# Altium project ZYNQ-7020-Core.PrjPcb (part 1 of 2)
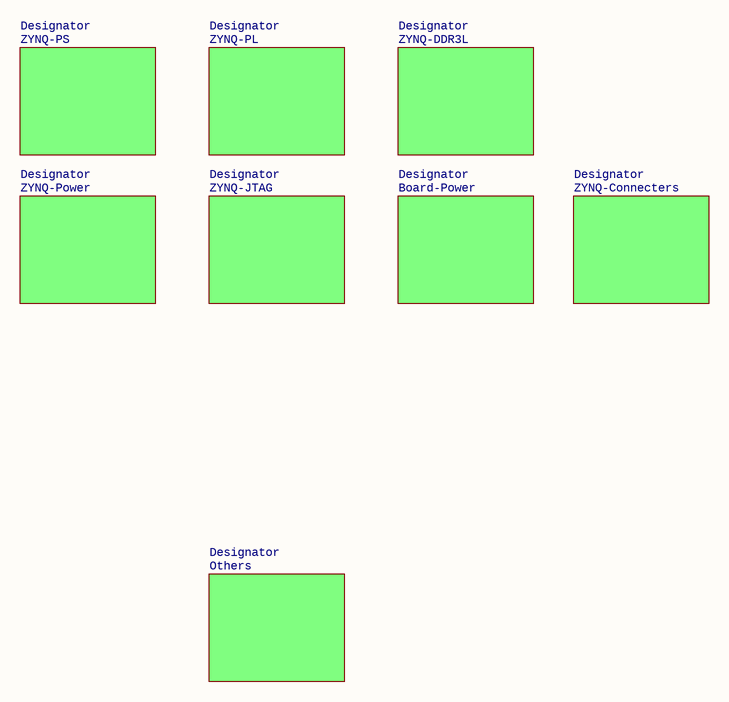
[diagram p0: Top.SchDoc]
9 sheets, 309 parts. Net scope: global (net labels, ports and power ports of the same name join across sheets).
Board file: PCB1.PcbDoc
Sheets:
  Top.SchDoc
    Designator = ZYNQ-PS.SchDoc
    Designator = ZYNQ-Power.SchDoc
    Designator = ZYNQ-PL.SchDoc
    Designator = ZYNQ-DDR3L.SchDoc
    Designator = ZYNQ-JTAG.SchDoc
    Designator = Board-Power.SchDoc
    Designator = Others.SchDoc
    Designator = ZYNQ-Connecters.SchDoc

## Sheet Top.SchDoc
size A3; DrawnBy: 23; Address4: Top; SheetNumber: 1; SheetTotal: 9

### Sub-sheets
Designator = ZYNQ-PS: no entries
Designator = ZYNQ-Power: no entries
Designator = ZYNQ-PL: no entries
Designator = ZYNQ-DDR3L: no entries
Designator = ZYNQ-JTAG: no entries
Designator = Board-Power: no entries
Designator = Others: no entries
Designator = ZYNQ-Connecters: no entries

## Sheet ZYNQ-PS.SchDoc
size A3; SheetNumber: 2; SheetTotal: 9
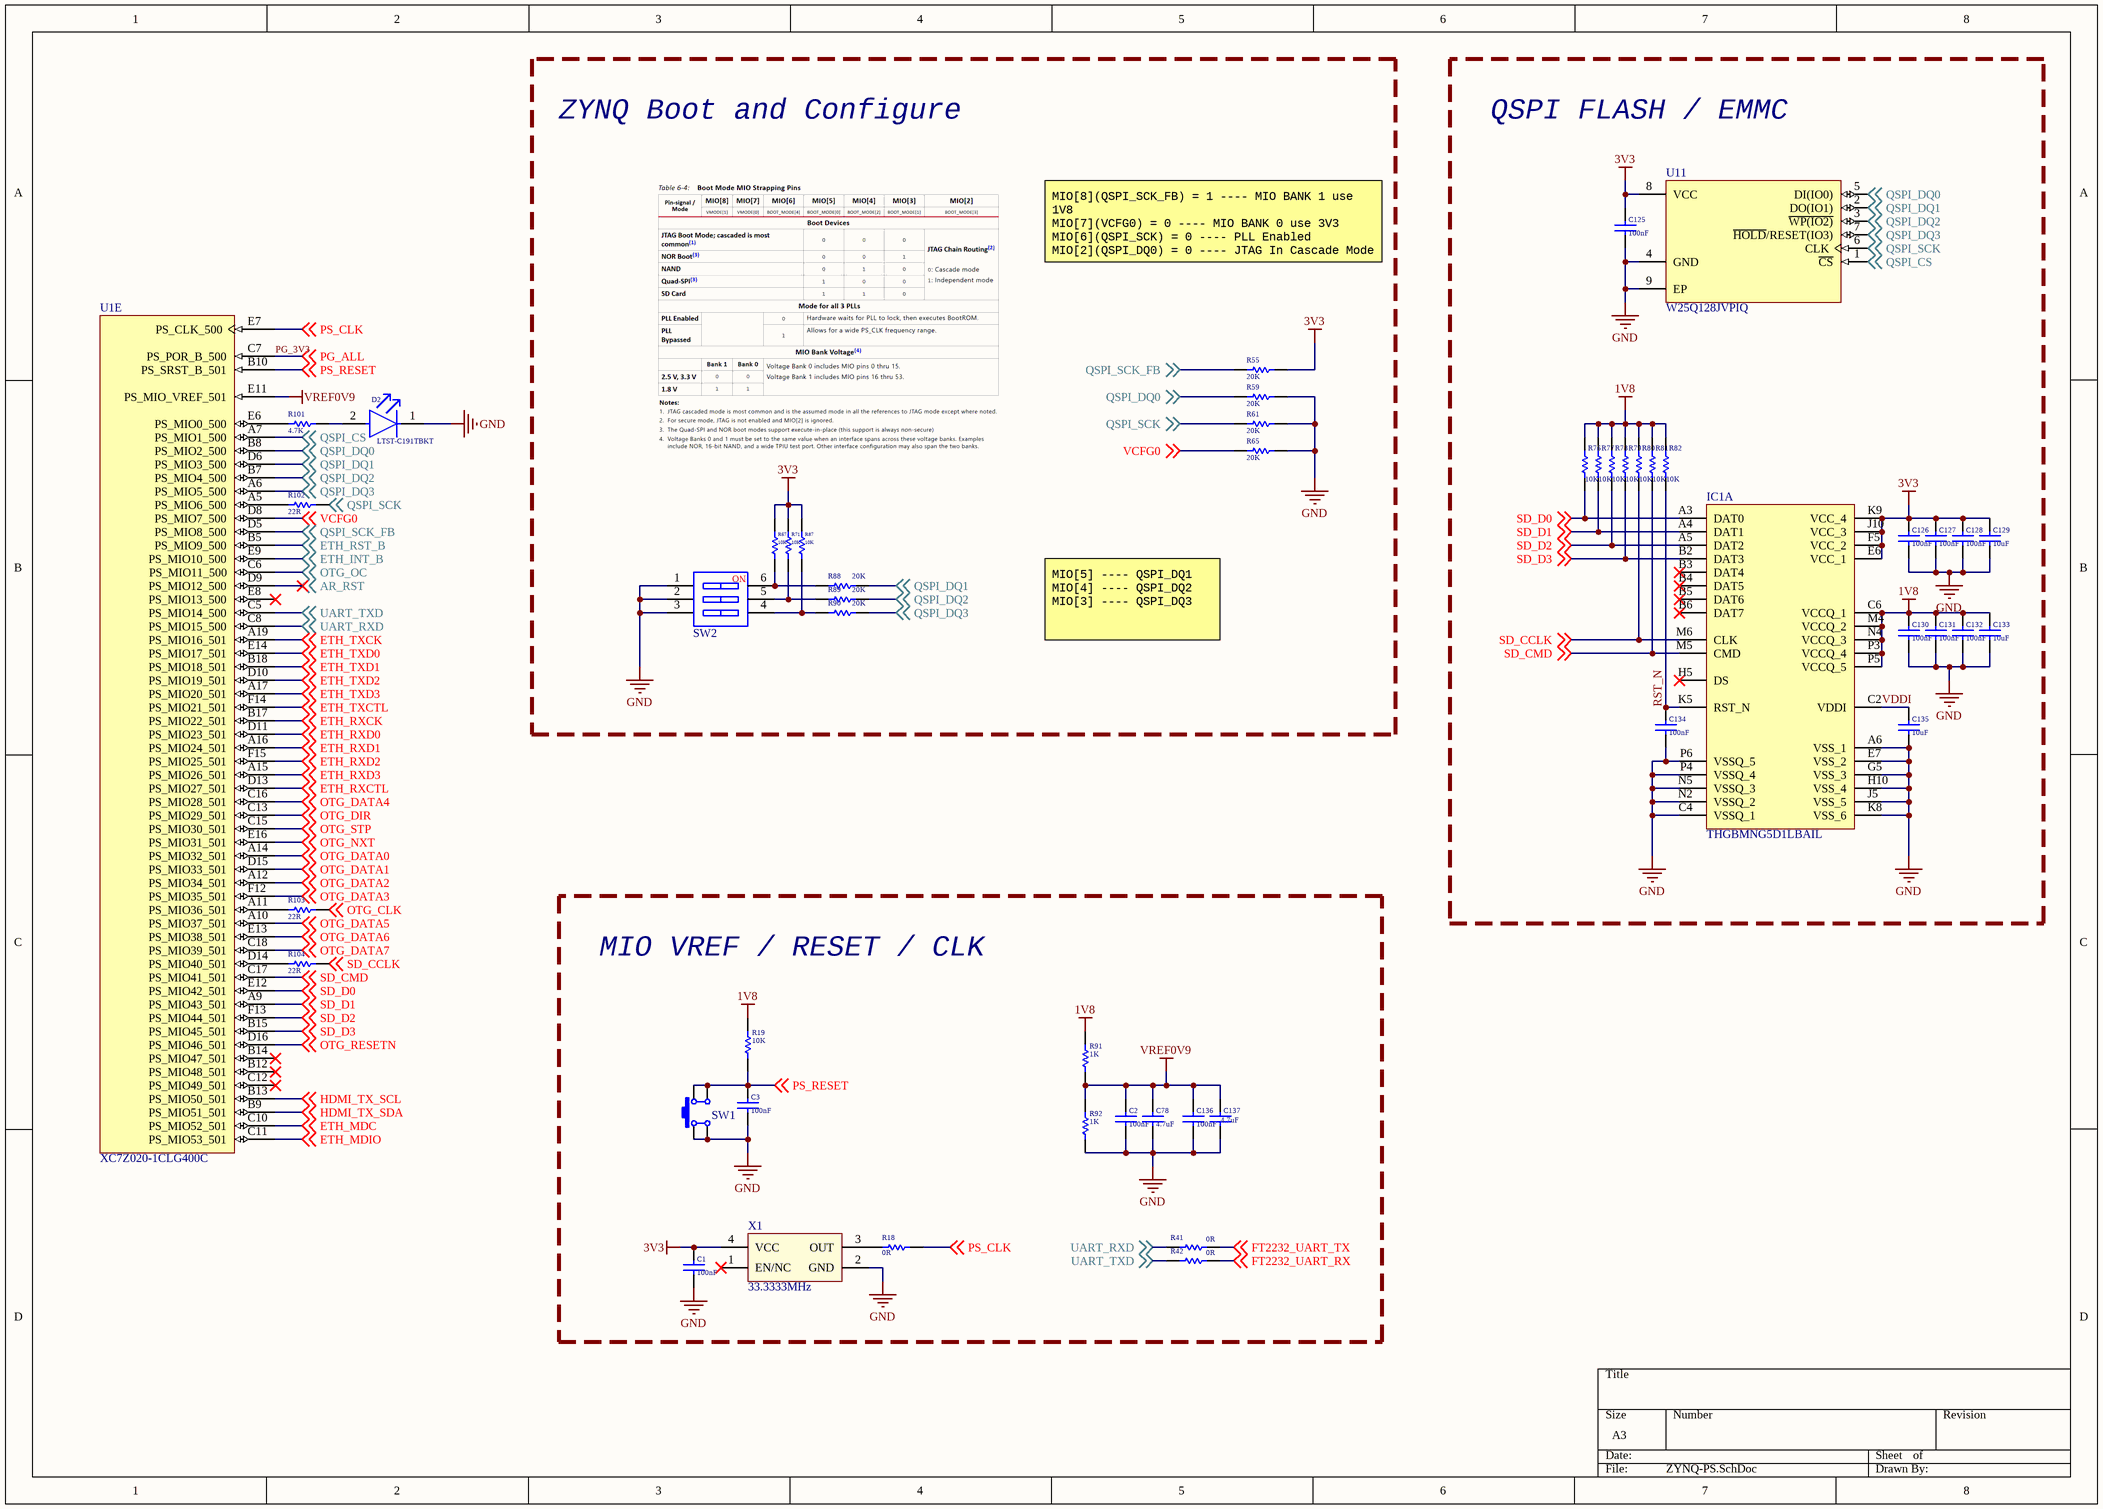
[diagram p1: ZYNQ-PS.SchDoc]

### Parts
C1  100nF  [CAPC1005X55X25LL05T10]
C2  100nF  [CAPC1005X55X25LL05T10]
C3  100nF  [CAPC1005X55X25LL05T10]
C78  4.7uF  [CAPC1005X55X25LL05T10]
C125  100nF  [CAPC1005X55X25LL05T10]
C126  100nF  [CAPC1005X55X25LL05T10]
C127  100nF  [CAPC1005X55X25LL05T10]
C128  100nF  [CAPC1005X55X25LL05T10]
C129  10uF  [CAPC1005X55X25LL05T10]
C130  100nF  [CAPC1005X55X25LL05T10]
C131  100nF  [CAPC1005X55X25LL05T10]
C132  100nF  [CAPC1005X55X25LL05T10]
C133  10uF  [CAPC1005X55X25LL05T10]
C134  100nF  [CAPC1005X55X25LL05T10]
C135  10uF  [CAPC1005X55X25LL05T10]
C136  100nF  [CAPC1005X55X25LL05T10]
C137  4.7uF  [CAPC1005X55X25LL05T10]
D2  LTST-C191TBKT  [FP-LTST-C191TBKT-MFG]
IC1  THGBMNG5D1LBAIL  [BGA153C50P14X14_1150X1300X80]  (part A of 2)
R18  0R  [RESC1005X40X25LL05T05]
R19  10K  [RESC1005X40X25LL05T05]
R41  0R  [RESC1005X40X25LL05T05]
R42  0R  [RESC1005X40X25LL05T05]
R55  20K  [RESC1005X40X25LL05T05]
R59  20K  [RESC1005X40X25LL05T05]
R61  20K  [RESC1005X40X25LL05T05]
R65  20K  [RESC1005X40X25LL05T05]
R67  10K  [RESC1005X40X25LL05T05]
R71  10K  [RESC1005X40X25LL05T05]
R76  10K  [RESC1005X40X25LL05T05]
R77  10K  [RESC1005X40X25LL05T05]
R78  10K  [RESC1005X40X25LL05T05]
R79  10K  [RESC1005X40X25LL05T05]
R80  10K  [RESC1005X40X25LL05T05]
R81  10K  [RESC1005X40X25LL05T05]
R82  10K  [RESC1005X40X25LL05T05]
R87  10K  [RESC1005X40X25LL05T05]
R88  20K  [RESC1005X40X25LL05T05]
R89  20K  [RESC1005X40X25LL05T05]
R90  20K  [RESC1005X40X25LL05T05]
R91  1K  [RESC1005X40X25LL05T05]
R92  1K  [RESC1005X40X25LL05T05]
R101  4.7K  [RESC1005X40X25LL05T05]
R102  22R  [RESC1005X40X25LL05T05]
R103  22R  [RESC1005X40X25LL05T05]
R104  22R  [RESC1005X40X25LL05T05]
SW1  3*4*2.5  [SW-SMD-4.2x3.2_4P]  (value not drawn)
SW2  DIP-SW-3P  [SW1.27 SMD-3P]  (value not drawn)
U1  XC7Z020-1CLG400C  [CLG400]  (part E of 9)
U11  W25Q128JVPIQ  [FP-ZP-IPC_C]
X1  33.3333MHz  [OSC-2025-4P]

### Blocks framed on the sheet
ZYNQ Boot and Configure: R55 R59 R61 R65 R67 R71 R87-R90 SW2
QSPI FLASH / EMMC: C125-C135 IC1 R76-R82 U11
MIO VREF / RESET / CLK: C1-C3 C78 C136 C137 R18 R19 R41 R42 R91 R92 SW1 X1

### Nets
1V8: C130.2 C131.2 C132.2 C133.2 IC1.C6(VCCQ_1) IC1.M4(VCCQ_2) IC1.N4(VCCQ_3) IC1.P3(VCCQ_4) IC1.P5(VCCQ_5) R19.2 R76.2 R77.2 R78.2 R79.2 R80.2 R81.2 R82.2 R91.2
3V3: C1.2 C125.2 C126.2 C127.2 C128.2 C129.2 IC1.E6(VCC_1) IC1.F5(VCC_2) IC1.J10(VCC_3) IC1.K9(VCC_4) R55.1 R67.1 R71.1 R87.1 U11.8(VCC) X1.4(VCC)
GND: C1.1 C2.1 C3.1 C78.1 C125.1 C126.1 C127.1 C128.1 C129.1 C130.1 C131.1 C132.1 C133.1 C134.1 C135.1 C136.1 C137.1 D2.1(C) IC1.A6(VSS_1) IC1.C4(VSSQ_1) IC1.E7(VSS_2) IC1.G5(VSS_3) IC1.H10(VSS_4) IC1.J5(VSS_5) IC1.K8(VSS_6) IC1.N2(VSSQ_2) IC1.N5(VSSQ_3) IC1.P4(VSSQ_4) IC1.P6(VSSQ_5) R59.1 R61.1 R65.1 R92.1 SW1.1 SW1.4 SW2.1 SW2.2 SW2.3 U11.4(GND) U11.9(EP) X1.2(GND)
VREF0V9: C2.2 C78.2 C136.2 C137.2 R91.1 R92.2 U1.E11(PS_MIO_VREF_501)
AR_RST: U1.D9(PS_MIO12_500) ; off-sheet AR_RST
ETH_INT_B: U1.E9(PS_MIO10_500) ; off-sheet ETH_INT_B
ETH_MDC: U1.C10(PS_MIO52_501) ; off-sheet ETH_MDC
ETH_MDIO: U1.C11(PS_MIO53_501) ; off-sheet ETH_MDIO
ETH_RST_B: U1.B5(PS_MIO9_500) ; off-sheet ETH_RST_B
ETH_RXCK: U1.B17(PS_MIO22_501) ; off-sheet ETH_RXCK
ETH_RXCTL: U1.D13(PS_MIO27_501) ; off-sheet ETH_RXCTL
ETH_RXD0: U1.D11(PS_MIO23_501) ; off-sheet ETH_RXD0
ETH_RXD1: U1.A16(PS_MIO24_501) ; off-sheet ETH_RXD1
ETH_RXD2: U1.F15(PS_MIO25_501) ; off-sheet ETH_RXD2
ETH_RXD3: U1.A15(PS_MIO26_501) ; off-sheet ETH_RXD3
ETH_TXCK: U1.A19(PS_MIO16_501) ; off-sheet ETH_TXCK
ETH_TXCTL: U1.F14(PS_MIO21_501) ; off-sheet ETH_TXCTL
ETH_TXD0: U1.E14(PS_MIO17_501) ; off-sheet ETH_TXD0
ETH_TXD1: U1.B18(PS_MIO18_501) ; off-sheet ETH_TXD1
ETH_TXD2: U1.D10(PS_MIO19_501) ; off-sheet ETH_TXD2
ETH_TXD3: U1.A17(PS_MIO20_501) ; off-sheet ETH_TXD3
FT2232_UART_RX: R42.1 ; off-sheet FT2232_UART_RX
FT2232_UART_TX: R41.1 ; off-sheet FT2232_UART_TX
HDMI_TX_SCL: U1.B13(PS_MIO50_501) ; off-sheet HDMI_TX_SCL
HDMI_TX_SDA: U1.B9(PS_MIO51_501) ; off-sheet HDMI_TX_SDA
OTG_CLK: R103.1 ; off-sheet OTG_CLK
OTG_DATA0: U1.A14(PS_MIO32_501) ; off-sheet OTG_DATA0
OTG_DATA1: U1.D15(PS_MIO33_501) ; off-sheet OTG_DATA1
OTG_DATA2: U1.A12(PS_MIO34_501) ; off-sheet OTG_DATA2
OTG_DATA3: U1.F12(PS_MIO35_501) ; off-sheet OTG_DATA3
OTG_DATA4: U1.C16(PS_MIO28_501) ; off-sheet OTG_DATA4
OTG_DATA5: U1.A10(PS_MIO37_501) ; off-sheet OTG_DATA5
OTG_DATA6: U1.E13(PS_MIO38_501) ; off-sheet OTG_DATA6
OTG_DATA7: U1.C18(PS_MIO39_501) ; off-sheet OTG_DATA7
OTG_DIR: U1.C13(PS_MIO29_501) ; off-sheet OTG_DIR
OTG_NXT: U1.E16(PS_MIO31_501) ; off-sheet OTG_NXT
OTG_OC: U1.C6(PS_MIO11_500) ; off-sheet OTG_OC
OTG_RESETN: U1.D16(PS_MIO46_501) ; off-sheet OTG_RESETN
OTG_STP: U1.C15(PS_MIO30_501) ; off-sheet OTG_STP
PG_3V3: U1.C7(PS_POR_B_500) ; off-sheet PG_ALL  [also labelled PG_ALL]
PS_CLK: R18.2 U1.E7(PS_CLK_500) ; off-sheet PS_CLK
PS_RESET: C3.2 R19.1 SW1.2 SW1.3 U1.B10(PS_SRST_B_501) ; off-sheet PS_RESET
QSPI_CS: U1.A7(PS_MIO1_500) U11.1(~{CS}) ; off-sheet QSPI_CS
QSPI_DQ0: R59.2 U1.B8(PS_MIO2_500) U11.5(DI(IO0)) ; off-sheet QSPI_DQ0
QSPI_DQ1: R88.1 U1.D6(PS_MIO3_500) U11.2(DO(IO1)) ; off-sheet QSPI_DQ1
QSPI_DQ2: R89.1 U1.B7(PS_MIO4_500) U11.3(~{WP(IO2)}) ; off-sheet QSPI_DQ2
QSPI_DQ3: R90.1 U1.A6(PS_MIO5_500) U11.7(~{HOLD}/RESET(IO3)) ; off-sheet QSPI_DQ3
QSPI_SCK: R61.2 R102.1 U11.6(CLK) ; off-sheet QSPI_SCK
QSPI_SCK_FB: R55.2 U1.D5(PS_MIO8_500) ; off-sheet QSPI_SCK_FB
RST_N: C134.2 IC1.K5(RST_N) R82.1
SD_CCLK: IC1.M6(CLK) R80.1 R104.1 ; off-sheet SD_CCLK
SD_CMD: IC1.M5(CMD) R81.1 U1.C17(PS_MIO41_501) ; off-sheet SD_CMD
SD_D0: IC1.A3(DAT0) R76.1 U1.E12(PS_MIO42_501) ; off-sheet SD_D0
SD_D1: IC1.A4(DAT1) R77.1 U1.A9(PS_MIO43_501) ; off-sheet SD_D1
SD_D2: IC1.A5(DAT2) R78.1 U1.F13(PS_MIO44_501) ; off-sheet SD_D2
SD_D3: IC1.B2(DAT3) R79.1 U1.B15(PS_MIO45_501) ; off-sheet SD_D3
UART_RXD: R41.2 U1.C8(PS_MIO15_500) ; off-sheet UART_RXD
UART_TXD: R42.2 U1.C5(PS_MIO14_500) ; off-sheet UART_TXD
VCFG0: R65.2 U1.D8(PS_MIO7_500) ; off-sheet VCFG0
VDDI: C135.2 IC1.C2(VDDI)
NetD2_2: D2.2(A) R101.1
NetR18_1: R18.1 X1.3(OUT)
NetR67_2: R67.2 R88.2 SW2.6
NetR71_2: R71.2 R89.2 SW2.5
NetR87_2: R87.2 R90.2 SW2.4
NetR101_2: R101.2 U1.E6(PS_MIO0_500)
NetR102_2: R102.2 U1.A5(PS_MIO6_500)
NetR103_2: R103.2 U1.A11(PS_MIO36_501)
NetR104_2: R104.2 U1.D14(PS_MIO40_501)

Not connected (* = marked no-connect by the designer): IC1 B3(DAT4)* B4(DAT5)* B5(DAT6)* B6(DAT7)* H5(DS)*; U1 B12(PS_MIO48_501)* B14(PS_MIO47_501)* C12(PS_MIO49_501)* E8(PS_MIO13_500)*; X1 1(EN/NC)*

### Notes on the sheet
- MIO[8](QSPI_SCK_FB) = 1 ---- MIO BANK 1 use 1V8
  MIO[7](VCFG0) = 0 ---- MIO BANK 0 use 3V3
  MIO[6](QSPI_SCK) = 0 ---- PLL Enabled
  MIO[2](QSPI_DQ0) = 0 ---- JTAG In Cascade Mode
- MIO[5] ---- QSPI_DQ1
  MIO[4] ---- QSPI_DQ2
  MIO[3] ---- QSPI_DQ3
- (in symbol DIP-SW-3P) NO

### Library data of the parts
C1-C3 C78 C125-C137 = CMP-2008-04639-1: Part Number: GRM155R71H104KE14D; Manufacturer: Murata
D2 = CMP-22017-000008-1: LED BLUE CLEAR CHIP SMD; Reverse Voltage: 5V; Dominant Wavelength: 475nm; Luminous Intensity: 180mcd; Number of LEDs: 1; Lens Color: Colorless; Lens Style: Diffused; Wavelength: 468nm; Forward Current: 20mA; Forward Voltage: 3.8V; Max Power Dissipation: 75mW; Viewing Angle: 130°; Power Dissipation: 76mW; Number of Pins: 2; Package Quantity: 1; Illumination Color: Blue; Lens Transparency: Clear; Max Operating Temperature: 80°C; Height: 0.55mm; Case Code (Imperial): 0603; Min Operating Temperature: -20°C; Width: 0.8mm; Test Current: 20mA; Depth: 1.6mm; Number of Elements: 1; Color: Blue; Lead Free: Lead Free; Packaging: Tape and Reel; Case Code (Metric): 1608; Radiation Hardening: No; Mount: Surface Mount; Length: 0.8mm; Case/Package: 0603
IC1 = THGBMNG5D1LBAIL: Integrated Circuit; Manufacturer_Name: Toshiba; Datasheet Link: https://datasheet.lcsc.com/szlcsc/1906131632_TOSHIBA-THGBMNG5D1LBAIL_C391255.pdf; Height: 0.8mm; Manufacturer_Part_Number: THGBMNG5D1LBAIL; Mouser Part Number: N/A; Mouser Price/Stock: https://www.mouser.co.uk/ProductDetail/Toshiba/THGBMNG5D1LBAIL?qs=Znm5pLBrcAKyiWgFGEjr8Q%3D%3D
R18 R19 R41 R42 R55 R59 R61 R65 R67 R71 R76-R82 R87-R92 R101-R104 = CMP-2002-00921-1: Manufacturer: Panasonic; Part Number: ERJ-2RKF40R2X
SW1 = SW SMD-3*4*2.5: 贴片4脚轻触开关; 联系下单店铺卖家 免费技术支持: 联系下单店铺卖家 免费帮你查找封装
SW2 = DIP-SW-3P: 3路拨码开关; 联系下单店铺卖家 免费技术支持: 联系下单店铺卖家 免费帮你查找封装; BOM名称: 3路拨码开关
U1 = CMP-0363-00002-3: 667 MHz Zynq™-7000 AP SoC, 130 PS I/O, 125 FPGA I/O, 400-Ball BGA, Speed Grade 1, Commercial Grade, Pb-Free; Flip Flops: 106400; Speed Grade: -1; LUTs: 53200; Extensible Block RAM (# 36Kb Blocks): 560 KB (140); PackageVersion: Rev 1.1, 09/2012; ComponentLink1Description: Datasheet; ComponentLink2Description: Package Specification; ComponentLink6Description: PCB and Layout Guide; PackageDescription: Wire-Bond Chip-Scale BGA, Body 17 x 17 mm, 0.8 mm Pitch; RoHS: Pb-Free; DatasheetVersion: v1.2; Mounting Technology: Surface Mount; ComponentLink5Description: Packaging and Pinout; ComponentLink5URL: http://www.xilinx.com/support/documentation/user_guides/ug865-Zynq-7000-Pkg-Pinout.pdf; ComponentLink6URL: http://www.xilinx.com/support/documentation/user_guides/ug483_7Series_PCB.pdf; Generic Part Number: XC7Z020; ComponentLink3Description: DC and AC Switching Characteristics; ComponentLink2URL: http://www.xilinx.com/support/documentation/user_guides/ug865-Zynq-7000-Pkg-Pinout.pdf; ComponentLink4Description: Package File; ComponentLink1URL: http://www.xilinx.com/support/documentation/data_sheets/ds190-Zynq-7000-Overview.pdf; PackageReference: CLG400; ComponentLink3URL: http://www.xilinx.com/support/documentation/data_sheets/ds187-XC7Z010-XC7Z020-Data-Sheet.pdf; PartNumber: XC7Z020-1CLG400C; ComponentLink4URL: http://www.xilinx.com/support/packagefiles/z7packages/xc7z020clg400pkg.txt; Code_JEDEC: MO-275-MMAA-1
U11 = CMP-00084-1: NOR Flash Serial (SPI, Dual SPI, Quad SPI) 3V/3.3V 128M-bit 16M x 8 6ns 8-Pin WSON EP T/R/Tray/Tube; Memory Format: Non-Volatile,FLASH; Frequency: 133MHz; Memory Size: 128Mb; Mounting Technology: Surface Mount; Packaging: Rail/Tube; Series: SpiFlash®; Max Operating Temperature: 85°C; RoHS Compliant: Yes; Min Operating Temperature: -40°C
X1 = XTAL-ACT-4P: 4脚有源晶振(振荡器); 联系下单店铺卖家 免费帮你查找封装: 联系下单店铺卖家 免费技术支持; BOM名称: 有源晶振(振荡器)

## Sheet ZYNQ-Power.SchDoc
size A3; SheetNumber: 3; SheetTotal: 9; SPICEModelCacheBYAJFYWK: <root> / <DocumentId>BYAJFYWK</DocumentId> / <CacheFrame Number="0"> / <Model Name="emk063bbj474_plf" Kind="CKT"> / <Text>* EMK063BBJ474_PLF     SPICE MODEL  ( General Type ) / *-------------------------------------------------------------------------------------------------------- / * Model Generated by TAIYO YUDEN Corporation (http://www.ty-top.com) / * Version 1.0 / * TAIYO YUDEN Control No. 170613 / * Copyright(c) 2017 TAIYO YUDEN CO.,LTD. All Rights Reserved. / *-------------------------------------------------------------------------------------------------------- / * / * Products Name : Multilayer Ceramic Capacitors / * / * Characteristics : / *     Capacitance : 0.47 uF , Rated Voltage : 16V , TCC : X5R / *     Case Size : 0.6 x 0.3 / 0.024 x 0.012 [mm/inch] , Thickness : 0.3 / 0.012 [mm/inch] / *     (Conditions: Temperature = 25 degC , DC Bias Current/Voltage = 0A / 0V) / * / * Frequency Range : 40Hz - 3GHz / * / * External Node Assignments : / * / *  1  o---| |---o  2 / * / *-------------------------------------------------------------------------------------------------------- / .SubCkt EMK063BBJ474_PLF 1 2 / **************************** / C0 1 110 0.343u / Cm 1 101 0.070566u / C1 101 102 0.19677u / Rc1 101 102 5.4832k / C2 102 103 0.088709u / Rc2 102 103 328.07 / C3 103 110 0.045948u / Rc3 103 110 5.95 / C2m 1 301 0.10435u / C21 301 302 1.1799u / Rc21 301 302 9.4241k / C22 302 303 0.78774u / Rc22 302 303 13.724k / C23 303 304 0.3659u / Rc23 303 304 10.75k / C24 304 305 0.19785u / Rc24 304 305 937.28 / C25 305 306 0.79433u / Rc25 305 306 187.76 / C26 306 307 0.2114u / Rc26 306 307 57.148 / C27 307 308 0.12309u / Rc27 307 308 22.875 / C28 308 309 0.060909u / Rc28 308 309 28.453 / C29 309 110 2918.5p / Rc29 309 110 0.61373 / Rp0 1 110 212.765957446809Meg / L0 110 120 0.12773n / Lm 120 130 0.093632n / L1 120 121 0.017026n / RL1 121 130 0.51897 / L2 120 122 0.039017n / RL2 122 130 1.1018 / L3 120 123 0.19653n / RL3 123 130 98.604m / CR 120 124 0.08294u / LR 124 125 0.038088n / RR 125 130 0.10805 / CL 130 140 3.8165p / LL 130 140 0.069007n / RL 130 140 4.9149k / Rs 140 2 8.9319m / **************************** / .ends EMK063BBJ474_PLF</Text> / </Model> / </CacheFrame> / </root>
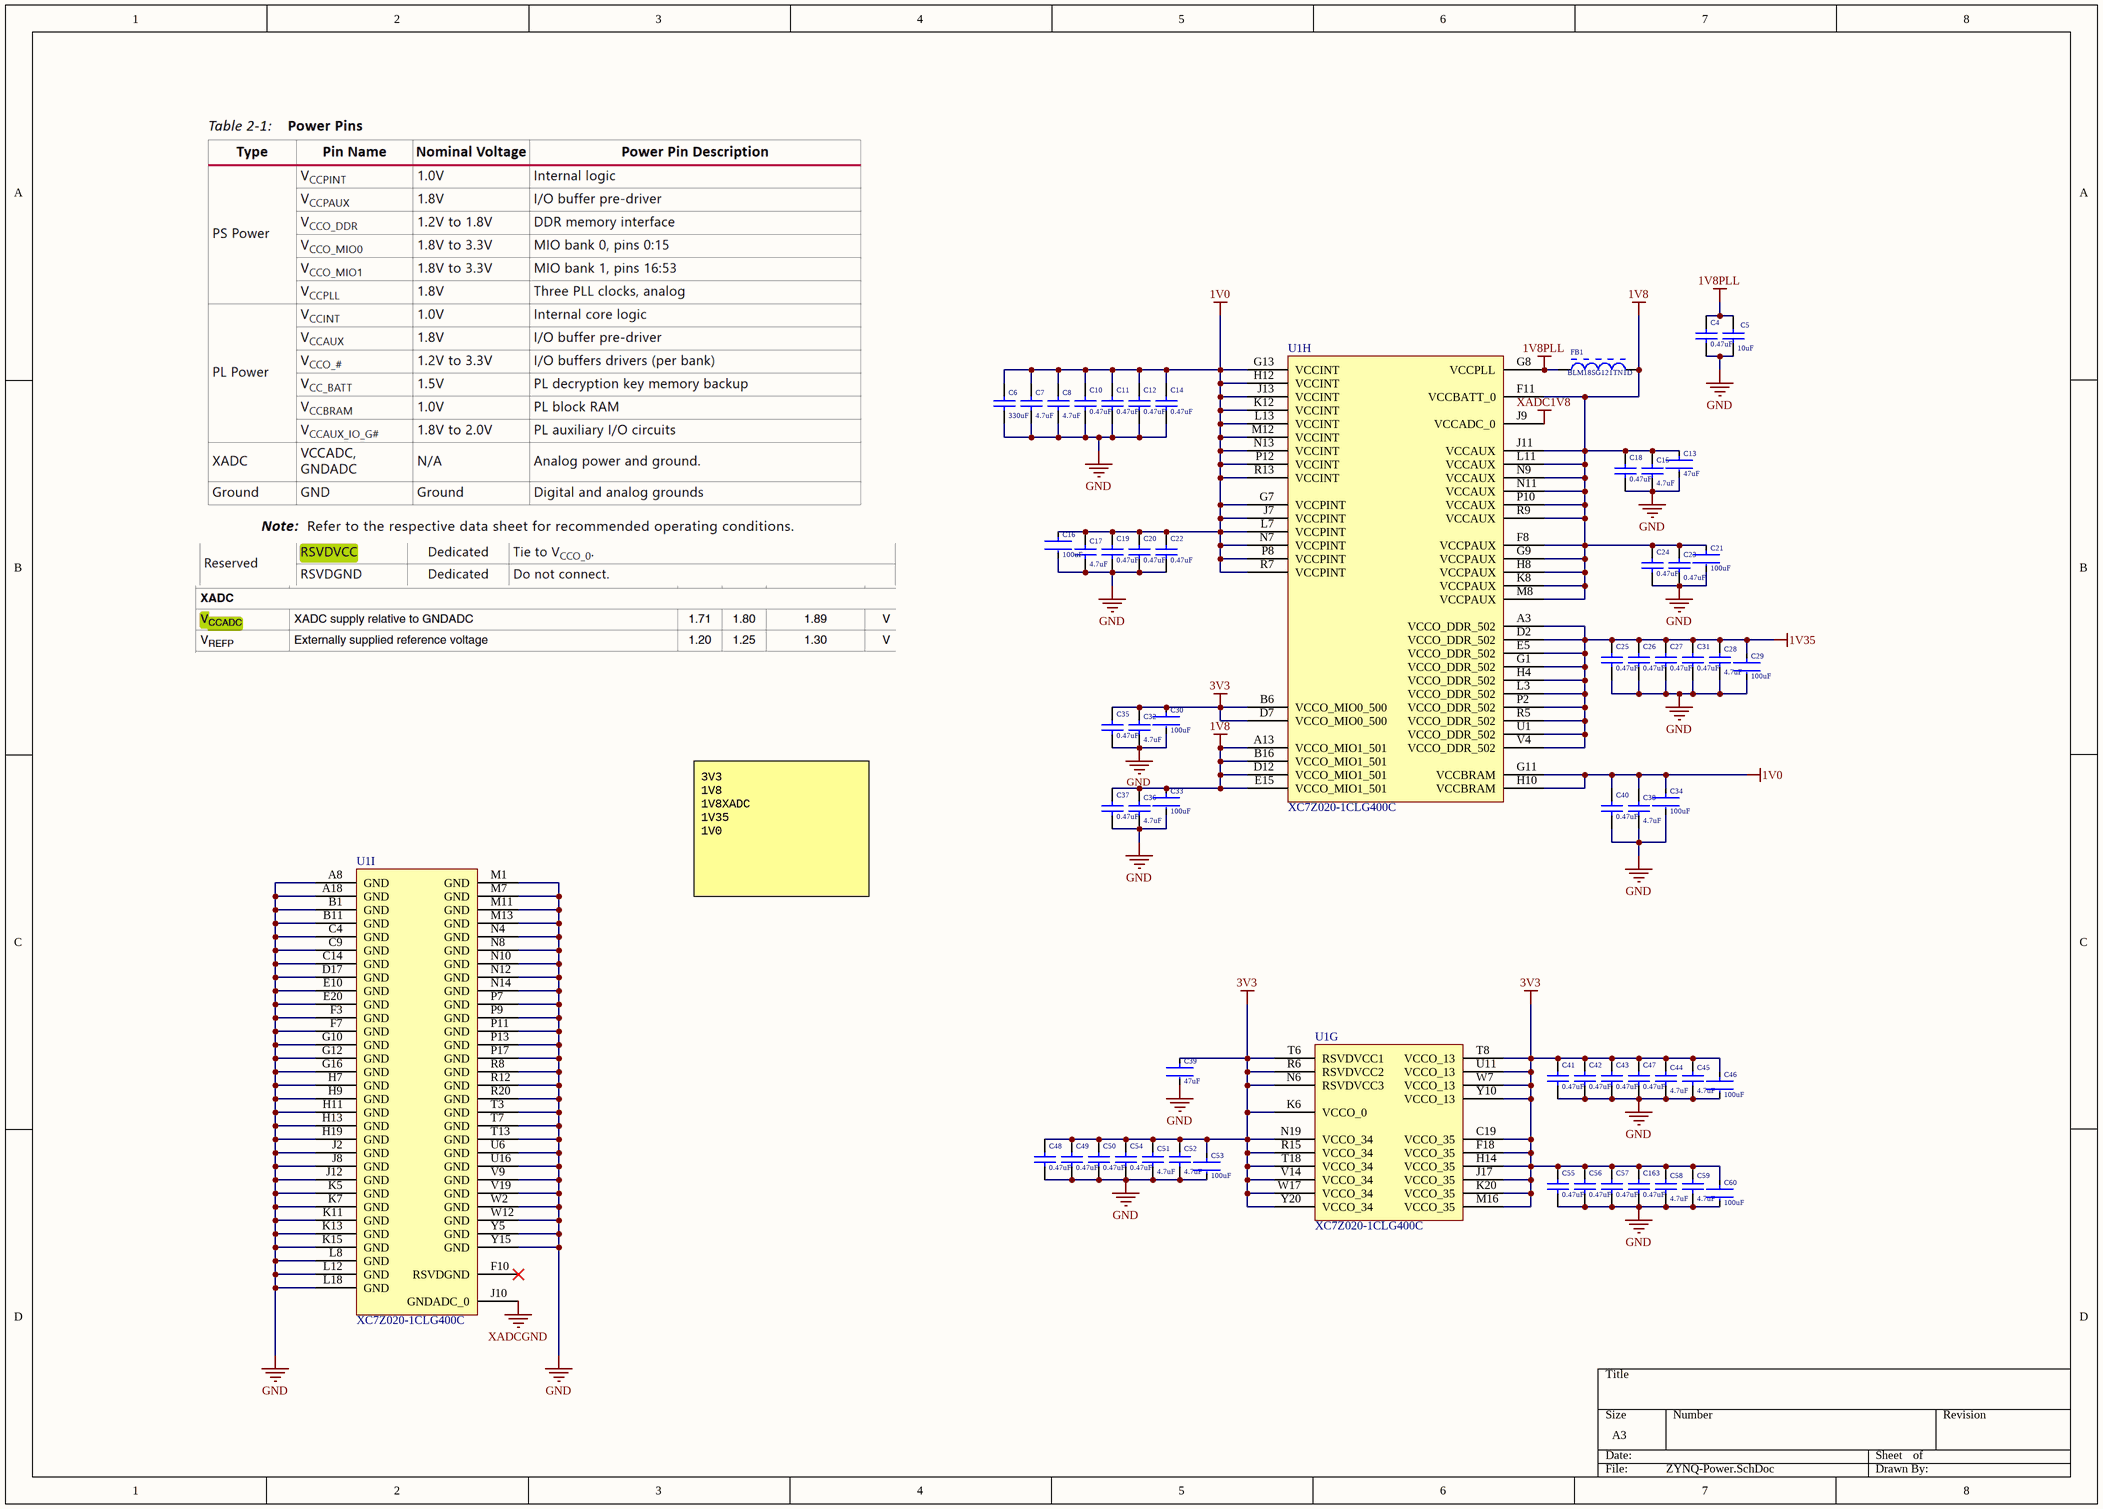
[diagram p2: ZYNQ-Power.SchDoc]

### Parts
C4  0.47uF  [FP-0201-L_0_6_0_09-W_0_3-IPC_A]
C5  10uF  [CAPC1608X90X35LL10T15]
C6  330uF  [CAPC3225X270X30LL30]
C7  4.7uF  [CAPC1005X55X25LL05T10]
C8  4.7uF  [CAPC1005X55X25LL05T10]
C10  0.47uF  [FP-0201-L_0_6_0_09-W_0_3-IPC_A]
C11  0.47uF  [FP-0201-L_0_6_0_09-W_0_3-IPC_A]
C12  0.47uF  [FP-0201-L_0_6_0_09-W_0_3-IPC_A]
C13  47uF  [FP-GCM31C-0_2-e0_3_0_8-IPC_C]
C14  0.47uF  [FP-0201-L_0_6_0_09-W_0_3-IPC_A]
C15  4.7uF  [CAPC1005X55X25LL05T10]
C16  100uF  [FP-GCM31C-0_2-e0_3_0_8-IPC_C]
C17  4.7uF  [CAPC1005X55X25LL05T10]
C18  0.47uF  [FP-0201-L_0_6_0_09-W_0_3-IPC_A]
C19  0.47uF  [FP-0201-L_0_6_0_09-W_0_3-IPC_A]
C20  0.47uF  [FP-0201-L_0_6_0_09-W_0_3-IPC_A]
C21  100uF  [FP-GCM31C-0_2-e0_3_0_8-IPC_C]
C22  0.47uF  [FP-0201-L_0_6_0_09-W_0_3-IPC_A]
C23  0.47uF  [CAPC1005X55X25LL05T10]
C24  0.47uF  [FP-0201-L_0_6_0_09-W_0_3-IPC_A]
C25  0.47uF  [FP-0201-L_0_6_0_09-W_0_3-IPC_A]
C26  0.47uF  [FP-0201-L_0_6_0_09-W_0_3-IPC_A]
C27  0.47uF  [FP-0201-L_0_6_0_09-W_0_3-IPC_A]
C28  4.7uF  [CAPC1005X55X25LL05T10]
C29  100uF  [FP-GCM31C-0_2-e0_3_0_8-IPC_C]
C30  100uF  [FP-GCM31C-0_2-e0_3_0_8-IPC_C]
C31  0.47uF  [FP-0201-L_0_6_0_09-W_0_3-IPC_A]
C32  4.7uF  [CAPC1005X55X25LL05T10]
C33  100uF  [FP-GCM31C-0_2-e0_3_0_8-IPC_C]
C34  100uF  [FP-GCM31C-0_2-e0_3_0_8-IPC_C]
C35  0.47uF  [FP-0201-L_0_6_0_09-W_0_3-IPC_A]
C36  4.7uF  [CAPC1005X55X25LL05T10]
C37  0.47uF  [FP-0201-L_0_6_0_09-W_0_3-IPC_A]
C38  4.7uF  [CAPC1005X55X25LL05T10]
C39  47uF  [FP-GCM31C-0_2-e0_3_0_8-IPC_C]
C40  0.47uF  [FP-0201-L_0_6_0_09-W_0_3-IPC_A]
C41  0.47uF  [FP-0201-L_0_6_0_09-W_0_3-IPC_A]
C42  0.47uF  [FP-0201-L_0_6_0_09-W_0_3-IPC_A]
C43  0.47uF  [FP-0201-L_0_6_0_09-W_0_3-IPC_A]
C44  4.7uF  [CAPC1005X55X25LL05T10]
C45  4.7uF  [CAPC1005X55X25LL05T10]
C46  100uF  [FP-GCM31C-0_2-e0_3_0_8-IPC_C]
C47  0.47uF  [FP-0201-L_0_6_0_09-W_0_3-IPC_A]
C48  0.47uF  [FP-0201-L_0_6_0_09-W_0_3-IPC_A]
C49  0.47uF  [FP-0201-L_0_6_0_09-W_0_3-IPC_A]
C50  0.47uF  [FP-0201-L_0_6_0_09-W_0_3-IPC_A]
C51  4.7uF  [CAPC1005X55X25LL05T10]
C52  4.7uF  [CAPC1005X55X25LL05T10]
C53  100uF  [FP-GCM31C-0_2-e0_3_0_8-IPC_C]
C54  0.47uF  [FP-0201-L_0_6_0_09-W_0_3-IPC_A]
C55  0.47uF  [FP-0201-L_0_6_0_09-W_0_3-IPC_A]
C56  0.47uF  [FP-0201-L_0_6_0_09-W_0_3-IPC_A]
C57  0.47uF  [FP-0201-L_0_6_0_09-W_0_3-IPC_A]
C58  4.7uF  [CAPC1005X55X25LL05T10]
C59  4.7uF  [CAPC1005X55X25LL05T10]
C60  100uF  [FP-GCM31C-0_2-e0_3_0_8-IPC_C]
C163  0.47uF  [FP-0201-L_0_6_0_09-W_0_3-IPC_A]
FB1  BLM18SG121TN1D  [MURA-BLM18SG-B40-CHIP-2_V6]
U1  XC7Z020-1CLG400C  [CLG400]  (parts G,H,I of 9)

### Nets
1V0: C6.2 C7.2 C8.2 C10.2 C11.2 C12.2 C14.2 C16.1 C17.2 C19.2 C20.2 C22.2 C34.1 C38.2 C40.2 U1.G7(VCCPINT) U1.G11(VCCBRAM) U1.G13(VCCINT) U1.H10(VCCBRAM) U1.H12(VCCINT) U1.J7(VCCPINT) U1.J13(VCCINT) U1.K12(VCCINT) U1.L7(VCCPINT) U1.L13(VCCINT) U1.M12(VCCINT) U1.N7(VCCPINT) U1.N13(VCCINT) U1.P8(VCCPINT) U1.P12(VCCINT) U1.R7(VCCPINT) U1.R13(VCCINT)
1V8: C13.1 C15.2 C18.2 C21.1 C23.2 C24.2 C33.1 C36.2 C37.2 FB1.2 U1.A13(VCCO_MIO1_501) U1.B16(VCCO_MIO1_501) U1.D12(VCCO_MIO1_501) U1.E15(VCCO_MIO1_501) U1.F8(VCCPAUX) U1.F11(VCCBATT_0) U1.G9(VCCPAUX) U1.H8(VCCPAUX) U1.J11(VCCAUX) U1.K8(VCCPAUX) U1.L11(VCCAUX) U1.M8(VCCPAUX) U1.N9(VCCAUX) U1.N11(VCCAUX) U1.P10(VCCAUX) U1.R9(VCCAUX)
1V8PLL: C4.2 C5.2 FB1.1 U1.G8(VCCPLL)
1V35: C25.2 C26.2 C27.2 C28.2 C29.1 C31.2 U1.A3(VCCO_DDR_502) U1.D2(VCCO_DDR_502) U1.E5(VCCO_DDR_502) U1.G1(VCCO_DDR_502) U1.H4(VCCO_DDR_502) U1.L3(VCCO_DDR_502) U1.P2(VCCO_DDR_502) U1.R5(VCCO_DDR_502) U1.U1(VCCO_DDR_502) U1.V4(VCCO_DDR_502)
3V3: C30.1 C32.2 C35.2 C39.1 C41.2 C42.2 C43.2 C44.2 C45.2 C46.1 C47.2 C48.2 C49.2 C50.2 C51.2 C52.2 C53.1 C54.2 C55.2 C56.2 C57.2 C58.2 C59.2 C60.1 C163.2 U1.B6(VCCO_MIO0_500) U1.C19(VCCO_35) U1.D7(VCCO_MIO0_500) U1.F18(VCCO_35) U1.H14(VCCO_35) U1.J17(VCCO_35) U1.K6(VCCO_0) U1.K20(VCCO_35) U1.M16(VCCO_35) U1.N6(RSVDVCC3) U1.N19(VCCO_34) U1.R6(RSVDVCC2) U1.R15(VCCO_34) U1.T6(RSVDVCC1) U1.T8(VCCO_13) U1.T18(VCCO_34) U1.U11(VCCO_13) U1.V14(VCCO_34) U1.W7(VCCO_13) U1.W17(VCCO_34) U1.Y10(VCCO_13) U1.Y20(VCCO_34)
GND: C4.1 C5.1 C6.1 C7.1 C8.1 C10.1 C11.1 C12.1 C13.2 C14.1 C15.1 C16.2 C17.1 C18.1 C19.1 C20.1 C21.2 C22.1 C23.1 C24.1 C25.1 C26.1 C27.1 C28.1 C29.2 C30.2 C31.1 C32.1 C33.2 C34.2 C35.1 C36.1 C37.1 C38.1 C39.2 C40.1 C41.1 C42.1 C43.1 C44.1 C45.1 C46.2 C47.1 C48.1 C49.1 C50.1 C51.1 C52.1 C53.2 C54.1 C55.1 C56.1 C57.1 C58.1 C59.1 C60.2 C163.1 U1.A8(GND) U1.A18(GND) U1.B1(GND) U1.B11(GND) U1.C4(GND) U1.C9(GND) U1.C14(GND) U1.D17(GND) U1.E10(GND) U1.E20(GND) U1.F3(GND) U1.F7(GND) U1.G10(GND) U1.G12(GND) U1.G16(GND) U1.H7(GND) U1.H9(GND) U1.H11(GND) U1.H13(GND) U1.H19(GND) U1.J2(GND) U1.J8(GND) U1.J12(GND) U1.K5(GND) U1.K7(GND) U1.K11(GND) U1.K13(GND) U1.K15(GND) U1.L8(GND) U1.L12(GND) U1.L18(GND) U1.M1(GND) U1.M7(GND) U1.M11(GND) U1.M13(GND) U1.N4(GND) U1.N8(GND) U1.N10(GND) U1.N12(GND) U1.N14(GND) U1.P7(GND) U1.P9(GND) U1.P11(GND) U1.P13(GND) U1.P17(GND) U1.R8(GND) U1.R12(GND) U1.R20(GND) U1.T3(GND) U1.T7(GND) U1.T13(GND) U1.U6(GND) U1.U16(GND) U1.V9(GND) U1.V19(GND) U1.W2(GND) U1.W12(GND) U1.Y5(GND) U1.Y15(GND)
XADC1V8: U1.J9(VCCADC_0)
XADCGND: U1.J10(GNDADC_0)

Not connected (* = marked no-connect by the designer): U1 F10(RSVDGND)*

### Notes on the sheet
- 3V3
  1V8
  1V8XADC
  1V35
  1V0

### Library data of the parts
C4 C10-C12 C14 C18-C20 C22 C24-C27 C31 C35 C37 C40-C43 C47-C50 C54-C57 C163 = CMP-00086-2: Multilayer Ceramic Capacitor 0.47uF 16V 10% 0201 Paper T/R; Value: 470nF; Max Operating Temperature: -55°C; RoHS Compliant: Yes; Height: 390um; Voltage Rating (DC): 16V; Min Operating Temperature: -55°C; Case/Package: 0201; Voltage Rating: 16V; Tolerance: 10%; Material: Ceramic
C5 = CMP-2006-02787-1: GRM188R60G106ME47D Checked Multilayer Ceramic Capacitor, 10 uF, 4 V, ± 20%, X5R, 0603 [1608 Metric] Ceramic Capacitors 0.1; Manufacturer: Murata; Part Number: GRM188R60G106ME47D
C6 = CMP-1662-00021-1: GRM32ER60G337ME05L Checked / Multilayer Ceramic Capacitor, 330 uF, 4 V, ± 20%, X5R, 1210 [3225 Metric] Ceramic Capacitors 1.11; Current Rating: 3 A; Colour: Black; Gender: Male; Contact Plating: Gold; PackageDescription: 2-Pin Surface Mount Device, Body 3.2 x 2.5 mm; Package Quantity: 100; Height: 8.13 mm; Pins: 40; Mount: Through Hole; ComponentLink1URL: http://www.murata.com/; RoHSCompliant: True; Packaging: Tray; ComponentLink2URL: https://datasheet.ciiva.com/3776/2741grm32er71e226ke1523-3776996.pdf; Width: 2.34 mm; Radiation Hardening: No; Lead Pitch: 2.54 mm; Min Operating Temperature: -65degC; Contact Finish: Gold; REACH SVHC: Unknown; Max Operating Temperature: 105degC; DatasheetVersion: Aug-14; Length: 101.19 mm; Contact Material: Bronze; ComponentLink2Description: Datasheet; ComponentLink1Description: Manufacturer URL; PackageReference: 1210
C7 C8 C15 C17 C28 C32 C36 C38 C44 C45 C51 C52 C58 C59 = CMP-2008-04639-1: GRM155R61E475ME15D / Ceramic Capacitor, Multilayer, Ceramic, 25V, 20% +Tol, 20% -Tol, X5R, 15% TC, 4.7uF, Surface Mount, 0402 Capacitors 0.1615; Part Number: GRM155R71H104KE14D; Manufacturer: Murata
C13 C39 = CMP-00080-1: GRM31CR60J476KE19L Checked / Multilayer Ceramic Capacitor, 47 uF, 6.3 V, ± 10%, X5R, 1206 [3216 Metric] Ceramic Capacitors 0.42; RoHS Compliant: Yes
C16 C21 C29 C30 C33 C34 C46 C53 C60 = CMP-00080-1: GRM31CR61A107MEA8K Checked / SMD Multilayer Ceramic Capacitor, 100 µF, 10 V, 1206 [3216 Metric], ± 20%, X5R, GRM Series Ceramic Capacitors 0.58; RoHS Compliant: Yes
C23 = CMP-2008-04639-1: GRM155R61H474KE11D / Multilayer Ceramic Capacitor, 0.47 uF, 50 V, ± 10%, X5R, 0402 [1005 Metric] Ceramic Capacitors 0.1; Part Number: GRM155R71H104KE14D; Manufacturer: Murata
FB1 = CMP-0686-00602-3: Chip Ferrite Bead for Power Lines (Low DC Resistance Type), 120 Ohm, 3000 mA, -55 to 125 degC, 1.6 x 0.8 x 0.65 mm SMD, Tape and Reel; Manufacturer: Murata; Impedance (at 100 MHz): 120 Ohm +/- 25%; Rated Current: 3000 mA; DC Resistance: 0.025 Ohm Max.; ComponentLink3Description: Package Specification; PackageReference: BLM18_H650-2; DatasheetVersion: 08/2013; Packing: Tape and Reel; PartNumber: BLM18SG121TN1D; PackageDescription: 2-Pin Chip, Body 1.6 x 0.8 mm; ComponentLink2Description: Datasheet; ComponentLink3URL: http://www.murata.com/products/catalog/pdf/c31e.pdf; ComponentLink1URL: http://www.murata.com/; Operating Temperature Range: -55 to 125 degC; Mounting Technology: Surface Mount; ComponentLink2URL: http://www.murata.com/products/catalog/pdf/c31e.pdf; ComponentLink1Description: Manufacturer URL
U1 = CMP-0363-00002-3: as U1 on sheet ZYNQ-PS; PackageVersion: Rev 1.1, 09/2012; ComponentLink1Description: Datasheet; ComponentLink2Description: Package Specification; ComponentLink6Description: PCB and Layout Guide; PackageDescription: Wire-Bond Chip-Scale BGA, Body 17 x 17 mm, 0.8 mm Pitch; RoHS: Pb-Free; DatasheetVersion: v1.2; Mounting Technology: Surface Mount; ComponentLink5Description: Packaging and Pinout; ComponentLink5URL: http://www.xilinx.com/support/documentation/user_guides/ug865-Zynq-7000-Pkg-Pinout.pdf; ComponentLink6URL: http://www.xilinx.com/support/documentation/user_guides/ug483_7Series_PCB.pdf; Generic Part Number: XC7Z020; ComponentLink3Description: DC and AC Switching Characteristics; ComponentLink2URL: http://www.xilinx.com/support/documentation/user_guides/ug865-Zynq-7000-Pkg-Pinout.pdf; ComponentLink4Description: Package File; ComponentLink1URL: http://www.xilinx.com/support/documentation/data_sheets/ds190-Zynq-7000-Overview.pdf; PackageReference: CLG400; ComponentLink3URL: http://www.xilinx.com/support/documentation/data_sheets/ds187-XC7Z010-XC7Z020-Data-Sheet.pdf; PartNumber: XC7Z020-1CLG400C; ComponentLink4URL: http://www.xilinx.com/support/packagefiles/z7packages/xc7z020clg400pkg.txt; Code_JEDEC: MO-275-MMAA-1

## Sheet ZYNQ-PL.SchDoc
size A3; SheetNumber: 4; SheetTotal: 9
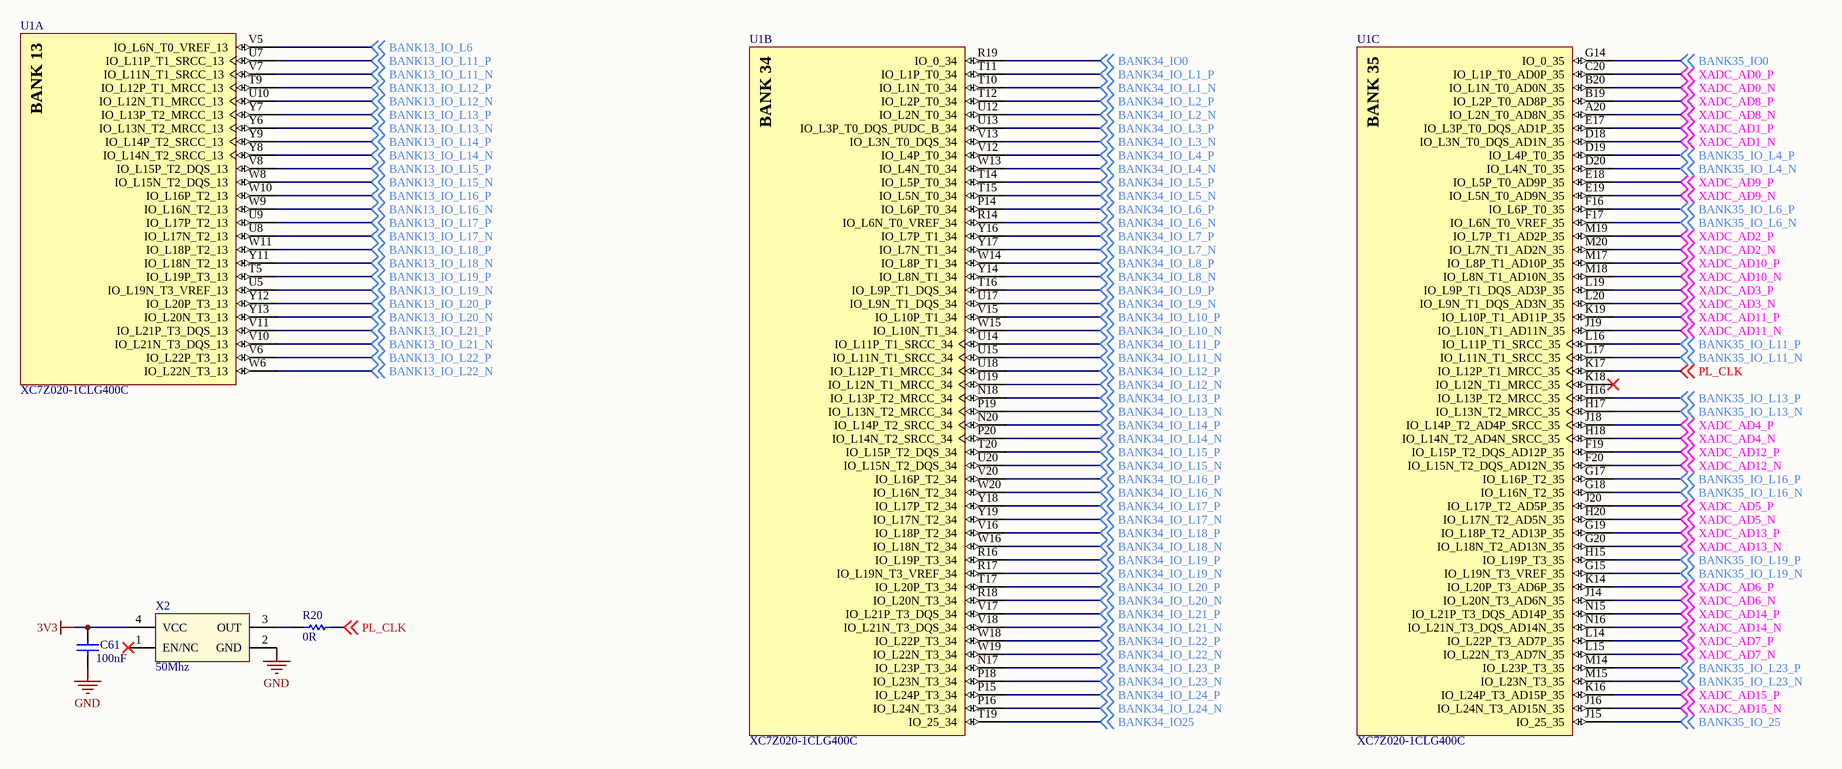
[diagram p3: ZYNQ-PL.SchDoc]

### Parts
C61  100nF  [CAPC1005X55X25LL05T10]
R20  0R  [RESC1005X40X25LL05T05]
U1  XC7Z020-1CLG400C  [CLG400]  (parts A,B,C of 9)
X2  50Mhz  [OSC-3225-4P]

### Nets
3V3: C61.2 X2.4(VCC)
GND: C61.1 X2.2(GND)
BANK13_IO_L6: U1.V5(IO_L6N_T0_VREF_13) ; off-sheet BANK13_IO_L6
BANK13_IO_L11_N: U1.V7(IO_L11N_T1_SRCC_13) ; off-sheet BANK13_IO_L11_N
BANK13_IO_L11_P: U1.U7(IO_L11P_T1_SRCC_13) ; off-sheet BANK13_IO_L11_P
BANK13_IO_L12_N: U1.U10(IO_L12N_T1_MRCC_13) ; off-sheet BANK13_IO_L12_N
BANK13_IO_L12_P: U1.T9(IO_L12P_T1_MRCC_13) ; off-sheet BANK13_IO_L12_P
BANK13_IO_L13_N: U1.Y6(IO_L13N_T2_MRCC_13) ; off-sheet BANK13_IO_L13_N
BANK13_IO_L13_P: U1.Y7(IO_L13P_T2_MRCC_13) ; off-sheet BANK13_IO_L13_P
BANK13_IO_L14_N: U1.Y8(IO_L14N_T2_SRCC_13) ; off-sheet BANK13_IO_L14_N
BANK13_IO_L14_P: U1.Y9(IO_L14P_T2_SRCC_13) ; off-sheet BANK13_IO_L14_P
BANK13_IO_L15_N: U1.W8(IO_L15N_T2_DQS_13) ; off-sheet BANK13_IO_L15_N
BANK13_IO_L15_P: U1.V8(IO_L15P_T2_DQS_13) ; off-sheet BANK13_IO_L15_P
BANK13_IO_L16_N: U1.W9(IO_L16N_T2_13) ; off-sheet BANK13_IO_L16_N
BANK13_IO_L16_P: U1.W10(IO_L16P_T2_13) ; off-sheet BANK13_IO_L16_P
BANK13_IO_L17_N: U1.U8(IO_L17N_T2_13) ; off-sheet BANK13_IO_L17_N
BANK13_IO_L17_P: U1.U9(IO_L17P_T2_13) ; off-sheet BANK13_IO_L17_P
BANK13_IO_L18_N: U1.Y11(IO_L18N_T2_13) ; off-sheet BANK13_IO_L18_N
BANK13_IO_L18_P: U1.W11(IO_L18P_T2_13) ; off-sheet BANK13_IO_L18_P
BANK13_IO_L19_N: U1.U5(IO_L19N_T3_VREF_13) ; off-sheet BANK13_IO_L19_N
BANK13_IO_L19_P: U1.T5(IO_L19P_T3_13) ; off-sheet BANK13_IO_L19_P
BANK13_IO_L20_N: U1.Y13(IO_L20N_T3_13) ; off-sheet BANK13_IO_L20_N
BANK13_IO_L20_P: U1.Y12(IO_L20P_T3_13) ; off-sheet BANK13_IO_L20_P
BANK13_IO_L21_N: U1.V10(IO_L21N_T3_DQS_13) ; off-sheet BANK13_IO_L21_N
BANK13_IO_L21_P: U1.V11(IO_L21P_T3_DQS_13) ; off-sheet BANK13_IO_L21_P
BANK13_IO_L22_N: U1.W6(IO_L22N_T3_13) ; off-sheet BANK13_IO_L22_N
BANK13_IO_L22_P: U1.V6(IO_L22P_T3_13) ; off-sheet BANK13_IO_L22_P
BANK34_IO0: U1.R19(IO_0_34) ; off-sheet BANK34_IO0
BANK34_IO25: U1.T19(IO_25_34) ; off-sheet BANK34_IO25
BANK34_IO_L1_N: U1.T10(IO_L1N_T0_34) ; off-sheet BANK34_IO_L1_N
BANK34_IO_L1_P: U1.T11(IO_L1P_T0_34) ; off-sheet BANK34_IO_L1_P
BANK34_IO_L2_N: U1.U12(IO_L2N_T0_34) ; off-sheet BANK34_IO_L2_N
BANK34_IO_L2_P: U1.T12(IO_L2P_T0_34) ; off-sheet BANK34_IO_L2_P
BANK34_IO_L3_N: U1.V13(IO_L3N_T0_DQS_34) ; off-sheet BANK34_IO_L3_N
BANK34_IO_L3_P: U1.U13(IO_L3P_T0_DQS_PUDC_B_34) ; off-sheet BANK34_IO_L3_P
BANK34_IO_L4_N: U1.W13(IO_L4N_T0_34) ; off-sheet BANK34_IO_L4_N
BANK34_IO_L4_P: U1.V12(IO_L4P_T0_34) ; off-sheet BANK34_IO_L4_P
BANK34_IO_L5_N: U1.T15(IO_L5N_T0_34) ; off-sheet BANK34_IO_L5_N
BANK34_IO_L5_P: U1.T14(IO_L5P_T0_34) ; off-sheet BANK34_IO_L5_P
BANK34_IO_L6_N: U1.R14(IO_L6N_T0_VREF_34) ; off-sheet BANK34_IO_L6_N
BANK34_IO_L6_P: U1.P14(IO_L6P_T0_34) ; off-sheet BANK34_IO_L6_P
BANK34_IO_L7_N: U1.Y17(IO_L7N_T1_34) ; off-sheet BANK34_IO_L7_N
BANK34_IO_L7_P: U1.Y16(IO_L7P_T1_34) ; off-sheet BANK34_IO_L7_P
BANK34_IO_L8_N: U1.Y14(IO_L8N_T1_34) ; off-sheet BANK34_IO_L8_N
BANK34_IO_L8_P: U1.W14(IO_L8P_T1_34) ; off-sheet BANK34_IO_L8_P
BANK34_IO_L9_N: U1.U17(IO_L9N_T1_DQS_34) ; off-sheet BANK34_IO_L9_N
BANK34_IO_L9_P: U1.T16(IO_L9P_T1_DQS_34) ; off-sheet BANK34_IO_L9_P
BANK34_IO_L10_N: U1.W15(IO_L10N_T1_34) ; off-sheet BANK34_IO_L10_N
BANK34_IO_L10_P: U1.V15(IO_L10P_T1_34) ; off-sheet BANK34_IO_L10_P
BANK34_IO_L11_N: U1.U15(IO_L11N_T1_SRCC_34) ; off-sheet BANK34_IO_L11_N
BANK34_IO_L11_P: U1.U14(IO_L11P_T1_SRCC_34) ; off-sheet BANK34_IO_L11_P
BANK34_IO_L12_N: U1.U19(IO_L12N_T1_MRCC_34) ; off-sheet BANK34_IO_L12_N
BANK34_IO_L12_P: U1.U18(IO_L12P_T1_MRCC_34) ; off-sheet BANK34_IO_L12_P
BANK34_IO_L13_N: U1.P19(IO_L13N_T2_MRCC_34) ; off-sheet BANK34_IO_L13_N
BANK34_IO_L13_P: U1.N18(IO_L13P_T2_MRCC_34) ; off-sheet BANK34_IO_L13_P
BANK34_IO_L14_N: U1.P20(IO_L14N_T2_SRCC_34) ; off-sheet BANK34_IO_L14_N
BANK34_IO_L14_P: U1.N20(IO_L14P_T2_SRCC_34) ; off-sheet BANK34_IO_L14_P
BANK34_IO_L15_N: U1.U20(IO_L15N_T2_DQS_34) ; off-sheet BANK34_IO_L15_N
BANK34_IO_L15_P: U1.T20(IO_L15P_T2_DQS_34) ; off-sheet BANK34_IO_L15_P
BANK34_IO_L16_N: U1.W20(IO_L16N_T2_34) ; off-sheet BANK34_IO_L16_N
BANK34_IO_L16_P: U1.V20(IO_L16P_T2_34) ; off-sheet BANK34_IO_L16_P
BANK34_IO_L17_N: U1.Y19(IO_L17N_T2_34) ; off-sheet BANK34_IO_L17_N
BANK34_IO_L17_P: U1.Y18(IO_L17P_T2_34) ; off-sheet BANK34_IO_L17_P
BANK34_IO_L18_N: U1.W16(IO_L18N_T2_34) ; off-sheet BANK34_IO_L18_N
BANK34_IO_L18_P: U1.V16(IO_L18P_T2_34) ; off-sheet BANK34_IO_L18_P
BANK34_IO_L19_N: U1.R17(IO_L19N_T3_VREF_34) ; off-sheet BANK34_IO_L19_N
BANK34_IO_L19_P: U1.R16(IO_L19P_T3_34) ; off-sheet BANK34_IO_L19_P
BANK34_IO_L20_N: U1.R18(IO_L20N_T3_34) ; off-sheet BANK34_IO_L20_N
BANK34_IO_L20_P: U1.T17(IO_L20P_T3_34) ; off-sheet BANK34_IO_L20_P
BANK34_IO_L21_N: U1.V18(IO_L21N_T3_DQS_34) ; off-sheet BANK34_IO_L21_N
BANK34_IO_L21_P: U1.V17(IO_L21P_T3_DQS_34) ; off-sheet BANK34_IO_L21_P
BANK34_IO_L22_N: U1.W19(IO_L22N_T3_34) ; off-sheet BANK34_IO_L22_N
BANK34_IO_L22_P: U1.W18(IO_L22P_T3_34) ; off-sheet BANK34_IO_L22_P
BANK34_IO_L23_N: U1.P18(IO_L23N_T3_34) ; off-sheet BANK34_IO_L23_N
BANK34_IO_L23_P: U1.N17(IO_L23P_T3_34) ; off-sheet BANK34_IO_L23_P
BANK34_IO_L24_N: U1.P16(IO_L24N_T3_34) ; off-sheet BANK34_IO_L24_N
BANK34_IO_L24_P: U1.P15(IO_L24P_T3_34) ; off-sheet BANK34_IO_L24_P
BANK35_IO0: U1.G14(IO_0_35) ; off-sheet BANK35_IO0
BANK35_IO_25: U1.J15(IO_25_35) ; off-sheet BANK35_IO_25
BANK35_IO_L4_N: U1.D20(IO_L4N_T0_35) ; off-sheet BANK35_IO_L4_N
BANK35_IO_L4_P: U1.D19(IO_L4P_T0_35) ; off-sheet BANK35_IO_L4_P
BANK35_IO_L6_N: U1.F17(IO_L6N_T0_VREF_35) ; off-sheet BANK35_IO_L6_N
BANK35_IO_L6_P: U1.F16(IO_L6P_T0_35) ; off-sheet BANK35_IO_L6_P
BANK35_IO_L11_N: U1.L17(IO_L11N_T1_SRCC_35) ; off-sheet BANK35_IO_L11_N
BANK35_IO_L11_P: U1.L16(IO_L11P_T1_SRCC_35) ; off-sheet BANK35_IO_L11_P
BANK35_IO_L13_N: U1.H17(IO_L13N_T2_MRCC_35) ; off-sheet BANK35_IO_L13_N
BANK35_IO_L13_P: U1.H16(IO_L13P_T2_MRCC_35) ; off-sheet BANK35_IO_L13_P
BANK35_IO_L16_N: U1.G18(IO_L16N_T2_35) ; off-sheet BANK35_IO_L16_N
BANK35_IO_L16_P: U1.G17(IO_L16P_T2_35) ; off-sheet BANK35_IO_L16_P
BANK35_IO_L19_N: U1.G15(IO_L19N_T3_VREF_35) ; off-sheet BANK35_IO_L19_N
BANK35_IO_L19_P: U1.H15(IO_L19P_T3_35) ; off-sheet BANK35_IO_L19_P
BANK35_IO_L23_N: U1.M15(IO_L23N_T3_35) ; off-sheet BANK35_IO_L23_N
BANK35_IO_L23_P: U1.M14(IO_L23P_T3_35) ; off-sheet BANK35_IO_L23_P
PL_CLK: R20.2 U1.K17(IO_L12P_T1_MRCC_35) ; off-sheet PL_CLK
XADC_AD0_N: U1.B20(IO_L1N_T0_AD0N_35) ; off-sheet XADC_AD0_N
XADC_AD0_P: U1.C20(IO_L1P_T0_AD0P_35) ; off-sheet XADC_AD0_P
XADC_AD1_N: U1.D18(IO_L3N_T0_DQS_AD1N_35) ; off-sheet XADC_AD1_N
XADC_AD1_P: U1.E17(IO_L3P_T0_DQS_AD1P_35) ; off-sheet XADC_AD1_P
XADC_AD2_N: U1.M20(IO_L7N_T1_AD2N_35) ; off-sheet XADC_AD2_N
XADC_AD2_P: U1.M19(IO_L7P_T1_AD2P_35) ; off-sheet XADC_AD2_P
XADC_AD3_N: U1.L20(IO_L9N_T1_DQS_AD3N_35) ; off-sheet XADC_AD3_N
XADC_AD3_P: U1.L19(IO_L9P_T1_DQS_AD3P_35) ; off-sheet XADC_AD3_P
XADC_AD4_N: U1.H18(IO_L14N_T2_AD4N_SRCC_35) ; off-sheet XADC_AD4_N
XADC_AD4_P: U1.J18(IO_L14P_T2_AD4P_SRCC_35) ; off-sheet XADC_AD4_P
XADC_AD5_N: U1.H20(IO_L17N_T2_AD5N_35) ; off-sheet XADC_AD5_N
XADC_AD5_P: U1.J20(IO_L17P_T2_AD5P_35) ; off-sheet XADC_AD5_P
XADC_AD6_N: U1.J14(IO_L20N_T3_AD6N_35) ; off-sheet XADC_AD6_N
XADC_AD6_P: U1.K14(IO_L20P_T3_AD6P_35) ; off-sheet XADC_AD6_P
XADC_AD7_N: U1.L15(IO_L22N_T3_AD7N_35) ; off-sheet XADC_AD7_N
XADC_AD7_P: U1.L14(IO_L22P_T3_AD7P_35) ; off-sheet XADC_AD7_P
XADC_AD8_N: U1.A20(IO_L2N_T0_AD8N_35) ; off-sheet XADC_AD8_N
XADC_AD8_P: U1.B19(IO_L2P_T0_AD8P_35) ; off-sheet XADC_AD8_P
XADC_AD9_N: U1.E19(IO_L5N_T0_AD9N_35) ; off-sheet XADC_AD9_N
XADC_AD9_P: U1.E18(IO_L5P_T0_AD9P_35) ; off-sheet XADC_AD9_P
XADC_AD10_N: U1.M18(IO_L8N_T1_AD10N_35) ; off-sheet XADC_AD10_N
XADC_AD10_P: U1.M17(IO_L8P_T1_AD10P_35) ; off-sheet XADC_AD10_P
XADC_AD11_N: U1.J19(IO_L10N_T1_AD11N_35) ; off-sheet XADC_AD11_N
XADC_AD11_P: U1.K19(IO_L10P_T1_AD11P_35) ; off-sheet XADC_AD11_P
XADC_AD12_N: U1.F20(IO_L15N_T2_DQS_AD12N_35) ; off-sheet XADC_AD12_N
XADC_AD12_P: U1.F19(IO_L15P_T2_DQS_AD12P_35) ; off-sheet XADC_AD12_P
XADC_AD13_N: U1.G20(IO_L18N_T2_AD13N_35) ; off-sheet XADC_AD13_N
XADC_AD13_P: U1.G19(IO_L18P_T2_AD13P_35) ; off-sheet XADC_AD13_P
XADC_AD14_N: U1.N16(IO_L21N_T3_DQS_AD14N_35) ; off-sheet XADC_AD14_N
XADC_AD14_P: U1.N15(IO_L21P_T3_DQS_AD14P_35) ; off-sheet XADC_AD14_P
XADC_AD15_N: U1.J16(IO_L24N_T3_AD15N_35) ; off-sheet XADC_AD15_N
XADC_AD15_P: U1.K16(IO_L24P_T3_AD15P_35) ; off-sheet XADC_AD15_P
NetR20_1: R20.1 X2.3(OUT)

Not connected (* = marked no-connect by the designer): U1 K18(IO_L12N_T1_MRCC_35)*; X2 1(EN/NC)*

### Notes on the sheet
- (in symbol CMP-0363-00002-3, part A) BANK 13
- (in symbol CMP-0363-00002-3, part B) BANK 34
- (in symbol CMP-0363-00002-3, part C) BANK 35

### Library data of the parts
C61 = CMP-2008-04639-1: as C1 on sheet ZYNQ-PS
R20 = CMP-2002-00921-1: as R18 on sheet ZYNQ-PS
U1 = CMP-0363-00002-3: as U1 on sheet ZYNQ-PS; PackageVersion: Rev 1.1, 09/2012; ComponentLink1Description: Datasheet; ComponentLink2Description: Package Specification; ComponentLink6Description: PCB and Layout Guide; PackageDescription: Wire-Bond Chip-Scale BGA, Body 17 x 17 mm, 0.8 mm Pitch; RoHS: Pb-Free; DatasheetVersion: v1.2; Mounting Technology: Surface Mount; ComponentLink5Description: Packaging and Pinout; ComponentLink5URL: http://www.xilinx.com/support/documentation/user_guides/ug865-Zynq-7000-Pkg-Pinout.pdf; ComponentLink6URL: http://www.xilinx.com/support/documentation/user_guides/ug483_7Series_PCB.pdf; Generic Part Number: XC7Z020; ComponentLink3Description: DC and AC Switching Characteristics; ComponentLink2URL: http://www.xilinx.com/support/documentation/user_guides/ug865-Zynq-7000-Pkg-Pinout.pdf; ComponentLink4Description: Package File; ComponentLink1URL: http://www.xilinx.com/support/documentation/data_sheets/ds190-Zynq-7000-Overview.pdf; PackageReference: CLG400; ComponentLink3URL: http://www.xilinx.com/support/documentation/data_sheets/ds187-XC7Z010-XC7Z020-Data-Sheet.pdf; PartNumber: XC7Z020-1CLG400C; ComponentLink4URL: http://www.xilinx.com/support/packagefiles/z7packages/xc7z020clg400pkg.txt; Code_JEDEC: MO-275-MMAA-1
X2 = XTAL-ACT-4P: as X1 on sheet ZYNQ-PS; BOM名称: 有源晶振(振荡器)

## Sheet ZYNQ-DDR3L.SchDoc
size A3; SheetNumber: 5; SheetTotal: 9
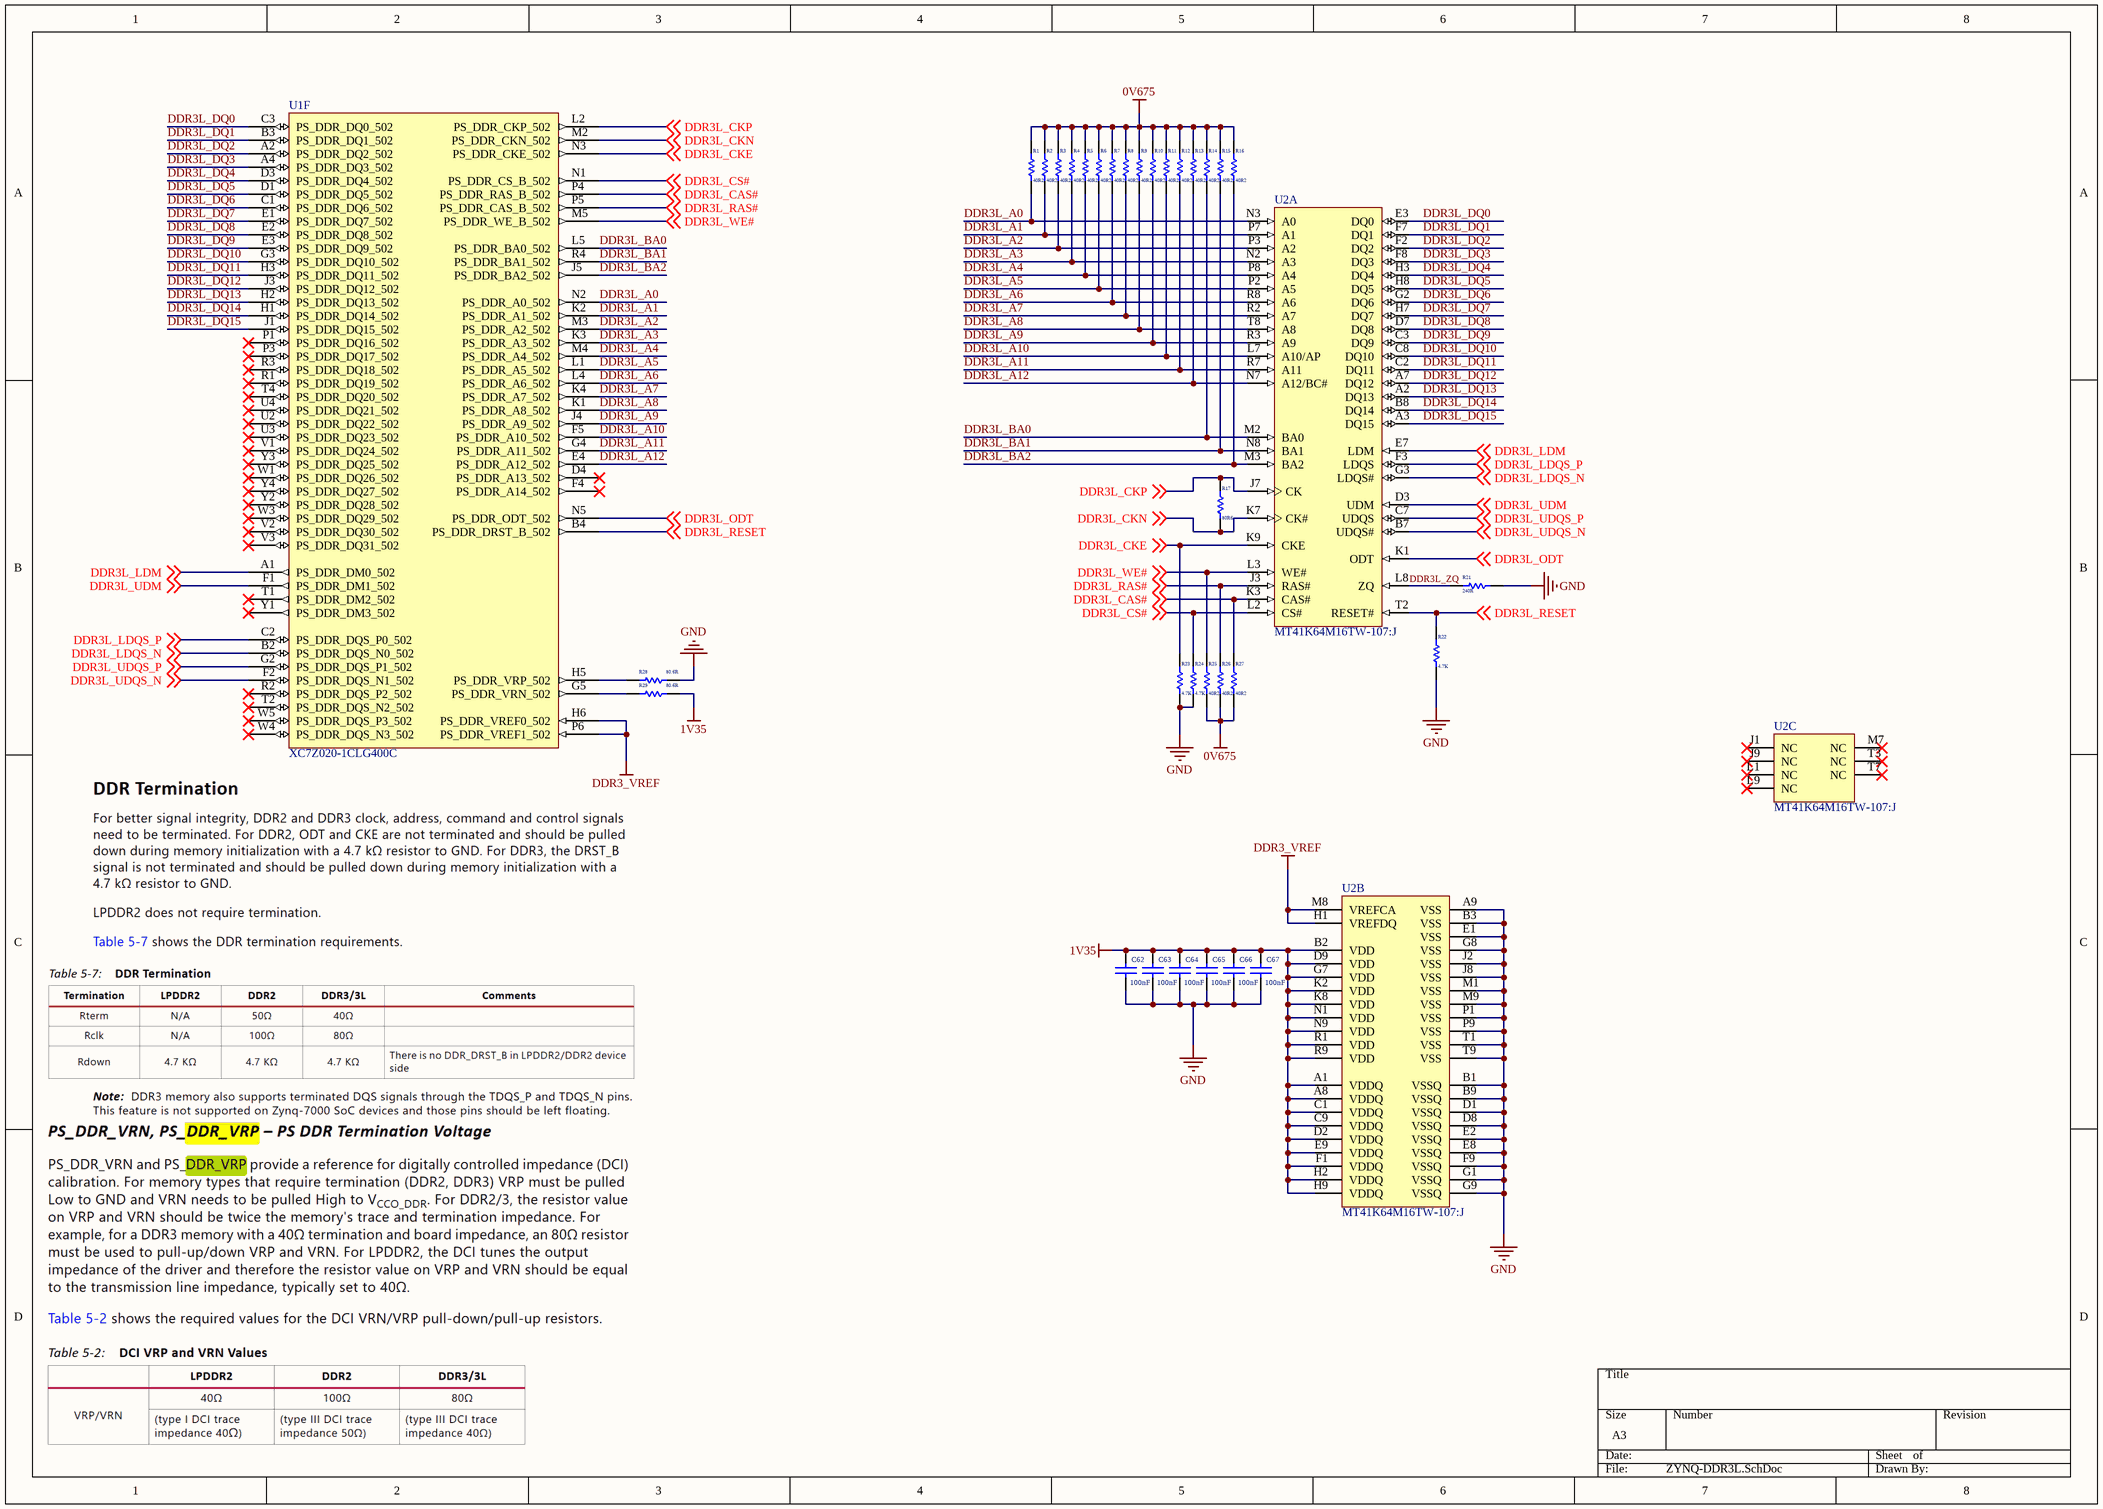
[diagram p4: ZYNQ-DDR3L.SchDoc]

### Parts
C62  100nF  [CAPC1005X55X25LL05T10]
C63  100nF  [CAPC1005X55X25LL05T10]
C64  100nF  [CAPC1005X55X25LL05T10]
C65  100nF  [CAPC1005X55X25LL05T10]
C66  100nF  [CAPC1005X55X25LL05T10]
C67  100nF  [CAPC1005X55X25LL05T10]
R1  40R2  [RESC1005X40X25LL05T05]
R2  40R2  [RESC1005X40X25LL05T05]
R3  40R2  [RESC1005X40X25LL05T05]
R4  40R2  [RESC1005X40X25LL05T05]
R5  40R2  [RESC1005X40X25LL05T05]
R6  40R2  [RESC1005X40X25LL05T05]
R7  40R2  [RESC1005X40X25LL05T05]
R8  40R2  [RESC1005X40X25LL05T05]
R9  40R2  [RESC1005X40X25LL05T05]
R10  40R2  [RESC1005X40X25LL05T05]
R11  40R2  [RESC1005X40X25LL05T05]
R12  40R2  [RESC1005X40X25LL05T05]
R13  40R2  [RESC1005X40X25LL05T05]
R14  40R2  [RESC1005X40X25LL05T05]
R15  40R2  [RESC1005X40X25LL05T05]
R16  40R2  [RESC1005X40X25LL05T05]
R17  80R6  [RESC1005X40X25LL05T05]
R21  240R  [RESC1005X40X25LL05T05]
R22  4.7K  [RESC1005X40X25LL05T05]
R23  4.7K  [RESC1005X40X25LL05T05]
R24  4.7K  [RESC1005X40X25LL05T05]
R25  40R2  [RESC1005X40X25LL05T05]
R26  40R2  [RESC1005X40X25LL05T05]
R27  40R2  [RESC1005X40X25LL05T05]
R28  80.6R  [RESC1005X40X25LL05T05]
R29  80.6R  [RESC1005X40X25LL05T05]
U1  XC7Z020-1CLG400C  [CLG400]  (part F of 9)
U2  MT41K64M16TW-107:J  [MICT-TW-96]  (parts A,B,C of 3)

### Nets
0V675: R1.2 R2.2 R3.2 R4.2 R5.2 R6.2 R7.2 R8.2 R9.2 R10.2 R11.2 R12.2 R13.2 R14.2 R15.2 R16.2 R25.1 R26.1 R27.1
1V35: C62.2 C63.2 C64.2 C65.2 C66.2 C67.2 R29.1 U2.A1(VDDQ) U2.A8(VDDQ) U2.B2(VDD) U2.C1(VDDQ) U2.C9(VDDQ) U2.D2(VDDQ) U2.D9(VDD) U2.E9(VDDQ) U2.F1(VDDQ) U2.G7(VDD) U2.H2(VDDQ) U2.H9(VDDQ) U2.K2(VDD) U2.K8(VDD) U2.N1(VDD) U2.N9(VDD) U2.R1(VDD) U2.R9(VDD)
DDR3_VREF: U1.H6(PS_DDR_VREF0_502) U1.P6(PS_DDR_VREF1_502) U2.H1(VREFDQ) U2.M8(VREFCA)
GND: C62.1 C63.1 C64.1 C65.1 C66.1 C67.1 R21.1 R22.1 R23.1 R24.1 R28.1 U2.A9(VSS) U2.B1(VSSQ) U2.B3(VSS) U2.B9(VSSQ) U2.D1(VSSQ) U2.D8(VSSQ) U2.E1(VSS) U2.E2(VSSQ) U2.E8(VSSQ) U2.F9(VSSQ) U2.G1(VSSQ) U2.G8(VSS) U2.G9(VSSQ) U2.J2(VSS) U2.J8(VSS) U2.M1(VSS) U2.M9(VSS) U2.P1(VSS) U2.P9(VSS) U2.T1(VSS) U2.T9(VSS)
DDR3L_A0: R1.1 U1.N2(PS_DDR_A0_502) U2.N3(A0)
DDR3L_A1: R2.1 U1.K2(PS_DDR_A1_502) U2.P7(A1)
DDR3L_A2: R3.1 U1.M3(PS_DDR_A2_502) U2.P3(A2)
DDR3L_A3: R4.1 U1.K3(PS_DDR_A3_502) U2.N2(A3)
DDR3L_A4: R5.1 U1.M4(PS_DDR_A4_502) U2.P8(A4)
DDR3L_A5: R6.1 U1.L1(PS_DDR_A5_502) U2.P2(A5)
DDR3L_A6: R7.1 U1.L4(PS_DDR_A6_502) U2.R8(A6)
DDR3L_A7: R8.1 U1.K4(PS_DDR_A7_502) U2.R2(A7)
DDR3L_A8: R9.1 U1.K1(PS_DDR_A8_502) U2.T8(A8)
DDR3L_A9: R10.1 U1.J4(PS_DDR_A9_502) U2.R3(A9)
DDR3L_A10: R11.1 U1.F5(PS_DDR_A10_502) U2.L7(A10/AP)
DDR3L_A11: R12.1 U1.G4(PS_DDR_A11_502) U2.R7(A11)
DDR3L_A12: R13.1 U1.E4(PS_DDR_A12_502) U2.N7(A12/BC#)
DDR3L_BA0: R14.1 U1.L5(PS_DDR_BA0_502) U2.M2(BA0)
DDR3L_BA1: R15.1 U1.R4(PS_DDR_BA1_502) U2.N8(BA1)
DDR3L_BA2: R16.1 U1.J5(PS_DDR_BA2_502) U2.M3(BA2)
DDR3L_CAS#: R27.2 U1.P4(PS_DDR_RAS_B_502) U2.K3(CAS#) ; off-sheet DDR3L_CAS#
DDR3L_CKE: R23.2 U1.N3(PS_DDR_CKE_502) U2.K9(CKE) ; off-sheet DDR3L_CKE
DDR3L_CKN: R17.1 U1.M2(PS_DDR_CKN_502) U2.K7(CK#) ; off-sheet DDR3L_CKN
DDR3L_CKP: R17.2 U1.L2(PS_DDR_CKP_502) U2.J7(CK) ; off-sheet DDR3L_CKP
DDR3L_CS#: R24.2 U1.N1(PS_DDR_CS_B_502) U2.L2(CS#) ; off-sheet DDR3L_CS#
DDR3L_DQ0: U1.C3(PS_DDR_DQ0_502) U2.E3(DQ0)
DDR3L_DQ1: U1.B3(PS_DDR_DQ1_502) U2.F7(DQ1)
DDR3L_DQ2: U1.A2(PS_DDR_DQ2_502) U2.F2(DQ2)
DDR3L_DQ3: U1.A4(PS_DDR_DQ3_502) U2.F8(DQ3)
DDR3L_DQ4: U1.D3(PS_DDR_DQ4_502) U2.H3(DQ4)
DDR3L_DQ5: U1.D1(PS_DDR_DQ5_502) U2.H8(DQ5)
DDR3L_DQ6: U1.C1(PS_DDR_DQ6_502) U2.G2(DQ6)
DDR3L_DQ7: U1.E1(PS_DDR_DQ7_502) U2.H7(DQ7)
DDR3L_DQ8: U1.E2(PS_DDR_DQ8_502) U2.D7(DQ8)
DDR3L_DQ9: U1.E3(PS_DDR_DQ9_502) U2.C3(DQ9)
DDR3L_DQ10: U1.G3(PS_DDR_DQ10_502) U2.C8(DQ10)
DDR3L_DQ11: U1.H3(PS_DDR_DQ11_502) U2.C2(DQ11)
DDR3L_DQ12: U1.J3(PS_DDR_DQ12_502) U2.A7(DQ12)
DDR3L_DQ13: U1.H2(PS_DDR_DQ13_502) U2.A2(DQ13)
DDR3L_DQ14: U1.H1(PS_DDR_DQ14_502) U2.B8(DQ14)
DDR3L_DQ15: U1.J1(PS_DDR_DQ15_502) U2.A3(DQ15)
DDR3L_LDM: U1.A1(PS_DDR_DM0_502) U2.E7(LDM) ; off-sheet DDR3L_LDM
DDR3L_LDQS_N: U1.B2(PS_DDR_DQS_N0_502) U2.G3(LDQS#) ; off-sheet DDR3L_LDQS_N
DDR3L_LDQS_P: U1.C2(PS_DDR_DQS_P0_502) U2.F3(LDQS) ; off-sheet DDR3L_LDQS_P
DDR3L_ODT: U1.N5(PS_DDR_ODT_502) U2.K1(ODT) ; off-sheet DDR3L_ODT
DDR3L_RAS#: R26.2 U1.P5(PS_DDR_CAS_B_502) U2.J3(RAS#) ; off-sheet DDR3L_RAS#
DDR3L_RESET: R22.2 U1.B4(PS_DDR_DRST_B_502) U2.T2(RESET#) ; off-sheet DDR3L_RESET
DDR3L_UDM: U1.F1(PS_DDR_DM1_502) U2.D3(UDM) ; off-sheet DDR3L_UDM
DDR3L_UDQS_N: U1.F2(PS_DDR_DQS_N1_502) U2.B7(UDQS#) ; off-sheet DDR3L_UDQS_N
DDR3L_UDQS_P: U1.G2(PS_DDR_DQS_P1_502) U2.C7(UDQS) ; off-sheet DDR3L_UDQS_P
DDR3L_WE#: R25.2 U1.M5(PS_DDR_WE_B_502) U2.L3(WE#) ; off-sheet DDR3L_WE#
DDR3L_ZQ: R21.2 U2.L8(ZQ)
NetR28_2: R28.2 U1.H5(PS_DDR_VRP_502)
NetR29_2: R29.2 U1.G5(PS_DDR_VRN_502)

Not connected (* = marked no-connect by the designer): U1 D4(PS_DDR_A13_502)* F4(PS_DDR_A14_502)* P1(PS_DDR_DQ16_502)* P3(PS_DDR_DQ17_502)* R1(PS_DDR_DQ19_502)* R2(PS_DDR_DQS_P2_502)* R3(PS_DDR_DQ18_502)* T1(PS_DDR_DM2_502)* T2(PS_DDR_DQS_N2_502)* T4(PS_DDR_DQ20_502)* U2(PS_DDR_DQ22_502)* U3(PS_DDR_DQ23_502)* U4(PS_DDR_DQ21_502)* V1(PS_DDR_DQ24_502)* V2(PS_DDR_DQ30_502)* V3(PS_DDR_DQ31_502)* W1(PS_DDR_DQ26_502)* W3(PS_DDR_DQ29_502)* W4(PS_DDR_DQS_N3_502)* W5(PS_DDR_DQS_P3_502)* Y1(PS_DDR_DM3_502)* Y2(PS_DDR_DQ28_502)* Y3(PS_DDR_DQ25_502)* Y4(PS_DDR_DQ27_502)*; U2 J1(NC)* J9(NC)* L1(NC)* L9(NC)* M7(NC)* T3(NC)* T7(NC)*

### Library data of the parts
C62-C67 = CMP-2008-04639-1: GRM155R71H104KE14D Checked / Multilayer Ceramic Capacitor, 0.1 uF, 50 V, ± 10%, X7R, 0402 [1005 Metric] Ceramic Capacitors 0.1; Manufacturer: Murata; Part Number: GRM155R71H104KE14D
R1-R17 R21-R29 = CMP-2002-00921-1: as R18 on sheet ZYNQ-PS
U1 = CMP-0363-00002-3: as U1 on sheet ZYNQ-PS; PackageVersion: Rev 1.1, 09/2012; ComponentLink1Description: Datasheet; ComponentLink2Description: Package Specification; ComponentLink6Description: PCB and Layout Guide; PackageDescription: Wire-Bond Chip-Scale BGA, Body 17 x 17 mm, 0.8 mm Pitch; RoHS: Pb-Free; DatasheetVersion: v1.2; Mounting Technology: Surface Mount; ComponentLink5Description: Packaging and Pinout; ComponentLink5URL: http://www.xilinx.com/support/documentation/user_guides/ug865-Zynq-7000-Pkg-Pinout.pdf; ComponentLink6URL: http://www.xilinx.com/support/documentation/user_guides/ug483_7Series_PCB.pdf; Generic Part Number: XC7Z020; ComponentLink3Description: DC and AC Switching Characteristics; ComponentLink2URL: http://www.xilinx.com/support/documentation/user_guides/ug865-Zynq-7000-Pkg-Pinout.pdf; ComponentLink4Description: Package File; ComponentLink1URL: http://www.xilinx.com/support/documentation/data_sheets/ds190-Zynq-7000-Overview.pdf; PackageReference: CLG400; ComponentLink3URL: http://www.xilinx.com/support/documentation/data_sheets/ds187-XC7Z010-XC7Z020-Data-Sheet.pdf; PartNumber: XC7Z020-1CLG400C; ComponentLink4URL: http://www.xilinx.com/support/packagefiles/z7packages/xc7z020clg400pkg.txt; Code_JEDEC: MO-275-MMAA-1
U2 = CMP-2000-06775-1: DDR3L SDRAM, 8 Meg x 16 x 8 Bank, 1.07 ns, 0 to 95 degC, 96-Ball FBGA (TW), Pb-Free; Manufacturer: Micron; Maximum Operating Current: 63mA; Operating Supply Voltage: 1.35V; Address Bus Width: 13Bit; Density: 1Gb; Lead Finish: Tin; Maximum Clock Rate: 933MHz; Organization: 64Mx16; Number of I/O Lines: 16Bit; Screening Level: Commercial; Max Processing Temp: 260; Manufacturer URL: http://www.micron.com/; Mounting Technology: SurfaceMount; Package Reference: TW-96; Datasheet Version: Rev. K, 09/2014; Operating Temperature: 0to95C; Data Bus Width: 16Bit; Datasheet URL: https://www.micron.com/~/media/documents/products/data-sheet/dram/ddr3/1gb_1_35v_ddr3l.pdf; Type: DDR3LSDRAM; Number of Bits per Word: 16Bit; Mounting: SurfaceMount; Package Description: 96-Ball Fine Pitch Ball Grid Array, Body 8 x 14 mm, Pitch 0.8 mm